# EAGLE design Wind Weather Station V2.1 (EAGLE 6.1)
COMPANY: ADAFRUIT INDUSTRIES; DRAWN: KTOWN; REV: B
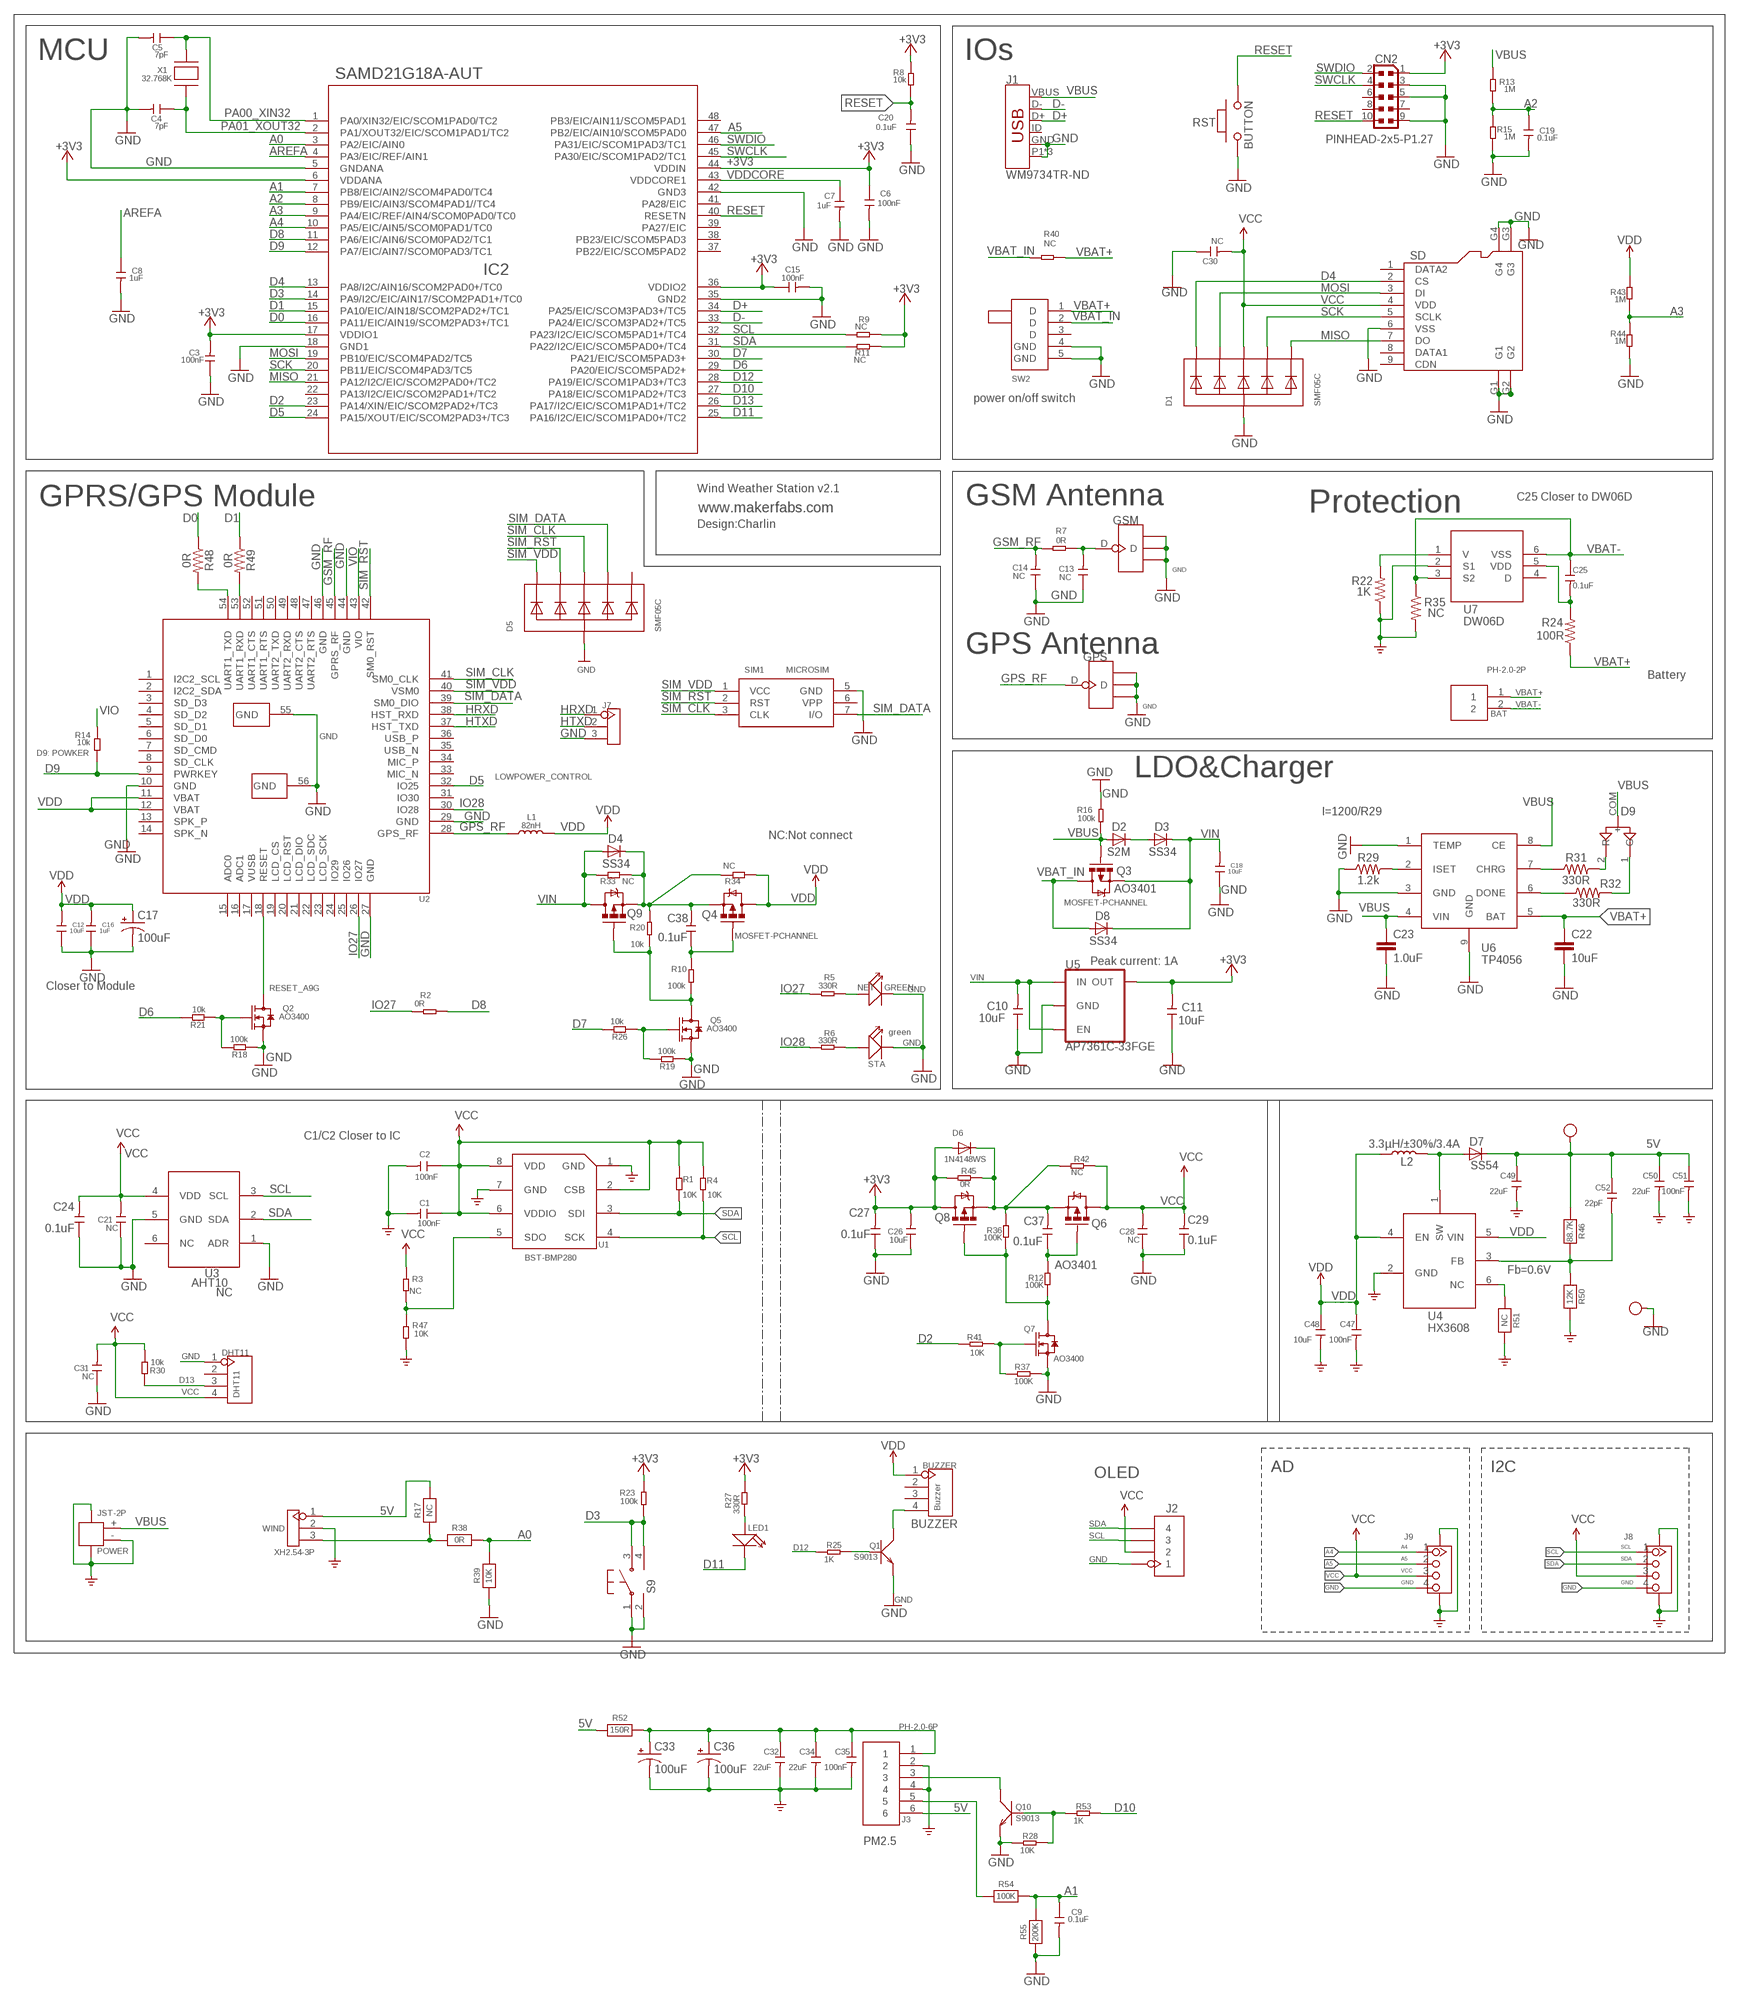
[diagram p0: schematic, sheet 1]

## Parts
5V  TEST-POINT'4545'  [TP-D45MIL]
BAT  PH-2.0-2P  [PH-2.0-2P]
BUZZER  Buzzer  HEADER-4P-60/35MILROUND  [4P-65/35ROUND]
C1  100nF  CAP-0603  [C0603]
C2  100nF  CAP-0603  [C0603]
C3  100nF  C-0603  [0603]
C4  7pF  C-0603  [0603]
C5  7pF  C-0603  [0603]
C6  100nF  C-0603  [0603]
C7  1uF  C-0603  [0603]
C8  1uF  C-0603  [0603]
C9  0.1uF  C-0603  [0603]
C10  10uF  C-0603  [0603]
C11  10uF  C-0603  [0603]
C12  10uF  C-0603  [0603]
C13  NC  C-0402  [0402]
C14  NC  C-0402  [0402]
C15  100nF  C-0603  [0603]
C16  1uF  C-0603  [0603]
C17  100uF  68UF-POLAR-EIA3528-10V-10%(TANT)  [EIA3528]
C18  10uF  C-0603  [0603]
C19  0.1uF  C-0603  [0603]
C20  0.1uF  C-0603  [0603]
C21  NC  C-0603  [0603]
C22  10uF  10UF-1206-6.3V-20%  [1206]
C23  1.0uF  1.0UF-0603-16V-10%  [0603]
C24  0.1uF  C-0603  [0603]
C25  0.1uF  C-0603  [0603]
C26  10uF  C-0603  [0603]
C27  0.1uF  C-0603  [0603]
C28  NC  C-0603  [0603]
C29  0.1uF  C-0603  [0603]
C30  NC  DISCRETE_C-0603  [DISCRETE_C0603]
C31  NC  C-0603  [0603]
C32  22uF  CAP-0603  [C0603]
C33  100uF  68UF-POLAR-EIA3528-10V-10%(TANT)  [EIA3528]
C34  22uF  CAP-0603  [C0603]
C35  100nF  CAP-0603  [C0603]
C36  100uF  68UF-POLAR-EIA3528-10V-10%(TANT)  [EIA3528]
C37  0.1uF  C-0603  [0603]
C38  0.1uF  C-0603  [0603]
C47  100nF  CAP-0603  [C0603]
C48  10uF  CAP-0603  [C0603]
C49  22uF  CAP-0603  [C0603]
C50  22uF  CAP-0603  [C0603]
C51  100nF  CAP-0603  [C0603]
C52  22pF  CAP-0603  [C0603]
CN2  PINHEAD-2x5-P1.27  0171_PH127-205DF055G00AROUND-PADS  [PINHEAD_2X05_127]
D1  SMF05C  TVSARRAY_5LANE  [SOT363]
D2  S2M  DIODE-DO-214AC  [DO-214AC]
D3  SS34  DIODE-DO-214AC  [DO-214AC]
D4  SS34  DIODE-DO-214AC  [DO-214AC]
D5  SMF05C  TVSARRAY_5LANE  [SOT363]
D6  1N4148WS  DIODESOD-323F  [SOD-323F]
D7  SS54  DIODE-DO-214AC  [DO-214AC]
D8  SS34  DIODE-DO-214AC  [DO-214AC]
D9  LED-ARG-3P'-3MM'  [LED-3P-2.54-3MM]
DHT11  DHT11  HEADER-4P-60/35MILROUND  [4P-65/35ROUND]
GND  TEST-POINT'4545'  [TP-D45MIL]
GPS  ANTENNA-U-FL  [4P-U-FL]
GSM  ANTENNA-U-FL  [4P-U-FL]
IC2  SAMD21G18A-AUT  ATSAMD21G18A-AUT  [TQFP48-7X7]
J1  WM9734TR-ND  USB_MICRO-B_FEMALE-SMT-VERT  [USB-B-MICRO-SMD_VERT]
J2  HEADER-1X4P  [SMD4-2.54P]
J3  PH-2.0-6P  [PH-2.0-6P]
J7  HEADER-3P-2.54  [3P-2.54]
J8  GROVE-CONNECTOR-SMD'90D'  [HW4-SMD-2.0-90D]
J9  GROVE-CONNECTOR-SMD'90D'  [HW4-SMD-2.0-90D]
L1  82nH  L'0603'  [L0603]
L2  3.3µH/±30%/3.4A  INDUCTOR-CR54-3.3UH  [CR54]
LED1  DISCRETE_LED0603  [DISCRETE_LED-0603]
NET  GREEN  DISCRETE_LED0603  [DISCRETE_LED-0603]
POWER  JST-2P  JST-2P-SMD'2.0'  [HW2-SMD-2.0-90D]
Q1  S9013  TRANSISTOR-NPN-SOT23  [SOT23]
Q2  AO3400  MOSFET-N'SOT23'  [SOT23@1]
Q3  MOSFET-PCHANNEL  [SOT23-3]
Q4  MOSFET-PCHANNEL  [SOT23-3]
Q5  AO3400  MOSFET-N'SOT23'  [SOT23@1]
Q6  MOSFET-PCHANNEL  [SOT23-3]
Q7  AO3400  DISCRETE_MOSFET-NSOT23  [DISCRETE_SOT23]
Q8  MOSFET-PCHANNEL  [SOT23-3]
Q9  MOSFET-PCHANNEL  [SOT23-3]
Q10  S9013  TRANSISTOR-NPN-SOT23  [SOT23]
R1  10K  RES-0603  [R0603]
R2  0R  R-0603  [R0603]
R3  NC  RES-0603  [R0603]
R4  10K  RES-0603  [R0603]
R5  330R  R-0603  [R0603]
R6  330R  R-0603  [R0603]
R7  0R  R-0603  [R0603]
R8  10k  R-0603  [R0603]
R9  NC  R-0603  [R0603]
R10  100k  R-0603  [R0603]
R11  NC  R-0603  [R0603]
R12  100K  R-0603  [R0603]
R13  1M  R-0603  [R0603]
R14  10k  R-0603  [R0603]
R15  1M  R-0603  [R0603]
R16  100k  R-0603  [R0603]
R17  NC  RESISTOR_0603_NOOUT  [0603-NO]
R18  100k  R-0603  [R0603]
R19  100k  R-0603  [R0603]
R20  10k  R-0603  [R0603]
R21  10k  R-0603  [R0603]
R22  1K  10KOHM-0603-1/10W-1%  [0603]
R23  100k  R-0603  [R0603]
R24  100R  10KOHM-0603-1/10W-1%  [0603]
R25  1K  R-0603  [R0603]
R26  10k  R-0603  [R0603]
R27  330R  R-0603  [R0603]
R28  10K  R-0603  [R0603]
R29  1.2k  2.49KOHM-0603-1/10W-1%  [0603]
R30  10k  R-0603  [R0603]
R31  330R  330OHM-0603-1/10W-1%  [0603]
R32  330R  330OHM-0603-1/10W-1%  [0603]
R33  NC  R-0603  [R0603]
R34  NC  R-0603  [R0603]
R35  NC  10KOHM-0603-1/10W-1%  [0603]
R36  100K  R-0603  [R0603]
R37  100K  R-0603  [R0603]
R38  0R  RESISTOR_0603_NOOUT  [0603-NO]
R39  10K  RESISTOR_0603_NOOUT  [0603-NO]
R40  NC  R-0603  [R0603]
R41  10K  R-0603  [R0603]
R42  NC  R-0603  [R0603]
R43  1M  R-0603  [R0603]
R44  1M  R-0603  [R0603]
R45  0R  R-0603  [R0603]
R46  88.7K  RESISTOR_0603_NOOUT  [0603-NO]
R47  10K  RES-0603  [R0603]
R48  0R  4.7KOHM-0603-1/10W-1%  [0603]
R49  0R  4.7KOHM-0603-1/10W-1%  [0603]
R50  12K  RESISTOR_0603_NOOUT  [0603-NO]
R51  NC  RESISTOR_0603_NOOUT  [0603-NO]
R52  150R  RESISTOR_0603_NOOUT  [0603-NO]
R53  1K  R-0603  [R0603]
R54  100K  RESISTOR_0603_NOOUT  [0603-NO]
R55  200K  RESISTOR_0603_NOOUT  [0603-NO]
RST  BUTTON  PB157  [157SW]
S9  SWITCHES  [SMD4-6*6]
SD  HOLDER-MICROSD-9P  [9P-SMD-W/-RING]
SIM1  MICROSIM  [MICROSIM]
STA  green  LED'0603'  [LED-0603]
SW2  SWITCH  [DIP5-8.6*4.5MM]
U1  BST-BMP280  SENSOR-BMP280  [LGA8-0.65-2X2.5X0.95MM]
U2  A9G  [A9G]
U3  AHT10  [SMD6-127P-400L500W]
U4  HX3608  [SOT-23-6]
U5  AP7361C-33FGE  [8-UDFN]
U6  TP4056  [SOP8-1.27P]
U7  DW06D  [SOT-23-6]
WIND  XH2.54-3P  [XH2.54-3P]
X1  32.768K  XTAL-3.2X1.5  [XTAL3215]

## Nets
5V: 5V.T C49.1 C50.1 C51.1 C52.1 D7.C J3.6 R17.2 R46.1 R52.1 WIND.1
+3V3: C3.2 C6.1 C11.2 C15.1 C26.2 C27.2 CN2.1 D6.A IC2.6(VDDANA) IC2.17(VDDIO1) IC2.36(VDDIO2) IC2.44(VDDIN) Q8.3(D) R8.2 R9.2 R11.2 R23.2 R27.2 R45.2 U5.1(OUT)
A0: IC2.3(PA2/EIC/AIN0) R38.2 R39.2
A1: C9.1 IC2.7(PB8/EIC/AIN2/SCOM4PAD0/TC4) R54.2 R55.2
A2: C19.1 IC2.8(PB9/EIC/AIN3/SCOM4PAD1//TC4) R13.1 R15.2
A3: IC2.9(PA4/EIC/REF/AIN4/SCOM0PAD0/TC0) R43.1 R44.2
A4: IC2.10(PA5/EIC/AIN5/SCOM0PAD1/TC0) J9.1
A5: IC2.47(PB2/EIC/AIN10/SCOM5PAD0) J9.2
AREFA: C8.1 IC2.4(PA3/EIC/REF/AIN1)
D0: IC2.16(PA11/EIC/AIN19/SCOM2PAD3+/TC1) R48.1
D1: IC2.15(PA10/EIC/AIN18/SCOM2PAD2+/TC1) R49.1
D2: IC2.23(PA14/XIN/EIC/SCOM2PAD2+/TC3) R41.2
D3: IC2.14(PA9/I2C/EIC/AIN17/SCOM2PAD1+/TC0) R23.1 S9.3 S9.4
D4: D1.1(C1) IC2.13(PA8/I2C/AIN16/SCOM2PAD0+/TC0) SD.2(CS)
D5: IC2.24(PA15/XOUT/EIC/SCOM2PAD3+/TC3) U2.32(IO25)
D6: IC2.29(PA20/EIC/SCOM5PAD2+) R21.2
D7: IC2.30(PA21/EIC/SCOM5PAD3+) R26.2
D8: IC2.11(PA6/EIC/AIN6/SCOM0PAD2/TC1) R2.2
D9: IC2.12(PA7/EIC/AIN7/SCOM0PAD3/TC1) R14.1 U2.9(PWRKEY)
D10: IC2.27(PA18/EIC/SCOM1PAD2+/TC3) R53.2
D11: IC2.25(PA16/I2C/EIC/SCOM1PAD0+/TC2) LED1.-
D12: IC2.28(PA19/EIC/SCOM1PAD3+/TC3) R25.1
D13: DHT11.3 IC2.26(PA17/I2C/EIC/SCOM1PAD1+/TC2) R30.1
D+: IC2.34(PA25/EIC/SCOM3PAD3+/TC5) J1.D+
D-: IC2.33(PA24/EIC/SCOM3PAD2+/TC5) J1.D-
DONE: R32.1 U6.6(DONE)
GND: C1.2 C2.2 C3.1 C4.2 C5.2 C6.2 C7.2 C8.2 C9.2 C10.1 C11.1 C12.1 C13.1 C14.1 C15.2 C16.1 C17.C(-) C18.1 C19.2 C20.1 C21.1 C22.2 C23.2 C24.1 C26.1 C27.1 C28.1 C29.1 C30.1 C31.1 C32.2 C33.C(-) C34.2 C35.2 C36.C(-) C47.2 C48.2 C49.2 C50.2 C51.2 CN2.3 CN2.5 CN2.9 D1.2(A) D5.2(A) DHT11.1 GND.T GPS.GND1 GPS.GND2 GPS.GND3 GSM.GND1 GSM.GND2 GSM.GND3 IC2.5(GNDANA) IC2.18(GND1) IC2.35(GND2) IC2.42(GND3) J1.GND J1.P1(SHIELD) J1.P2(SHIELD) J1.P3(SHIELD) J2.1 J3.2 J3.4 J7.3 J8.4 J8.SS1 J8.SS2 J9.4 J9.SS1 J9.SS2 NET.- POWER.3 POWER.4 POWER.- Q1.2(E) Q2.2(S) Q5.2(S) Q7.2(S) Q10.2(E) R15.1 R16.2 R18.1 R19.1 R22.1 R28.1 R29.1 R35.2 R37.1 R39.1 R44.1 R47.1 R50.2 R51.2 R55.1 RST.2 S9.1 S9.2 SD.6(VSS) SD.G1 SD.G2 SD.G3 SD.G4 SIM1.5(GND) STA.- SW2.4(GND) SW2.5(GND) U1.1(GND) U1.7(GND) U2.10(GND) U2.27(GND) U2.29(GND) U2.44(GND) U2.46(GND) U2.55(GND) U2.56(GND) U3.1(ADR) U3.5(GND) U4.2(GND) U5.4(GND) U5.EP(GND) U6.1(TEMP) U6.3(GND) U6.9(GND) U7.2(S1) WIND.2
GPS_RF: GPS.D L1.1 U2.28(GPS_RF)
GSM_RF: C14.2 R7.1 U2.45(GPRS_RF)
HRXD: J7.1 U2.38(HST_RXD)
HTXD: J7.2 U2.37(HST_TXD)
IO27: R2.1 R5.1 U2.26(IO27)
IO28: R6.1 U2.30(IO28)
ISET: R29.2 U6.2(ISET)
MISO: D1.6(C5) IC2.21(PA12/I2C/EIC/SCOM2PAD0+/TC2) SD.7(DO)
MOSI: D1.3(C2) IC2.19(PB10/EIC/SCOM4PAD2/TC5) SD.3(DI)
N$1: R6.2 STA.+
N$2: D2.C D3.A
N$3: C38.1 Q4.1(G) R10.2
N$4: Q5.1(G) R19.2 R26.1
N$5: LED1.+ R27.1
N$6: C37.2 D6.C Q6.2(S) Q8.2(S) R36.2 R42.2 R45.1
N$7: NET.+ R5.2
N$8: Q2.3(D) U2.18(RESET)
N$9: BUZZER.4 Q1.3(C)
N$10: R17.1 R38.1 WIND.3
N$11: C38.2 D4.C Q4.2(S) Q9.2(S) R20.2 R33.1 R34.2
N$12: Q2.1(G) R18.2 R21.1
N$13: D9.1(G) R32.2
N$14: R31.1 U6.7(CHRG)
N$15: Q7.3(D) Q8.1(G) R12.1 R36.1
N$16: C25.2 R24.2 U7.5(VDD)
N$17: R22.2 U7.1(V)
N$18: D9.2(R) R31.2
N$19: Q7.1(G) R37.2 R41.1
N$20: R3.1 R47.2 U1.5(SDO)
N$21: R49.2 U2.53(UART1_RXD)
N$22: R48.2 U2.54(UART1_TXD)
N$23: D7.A L2.P$2 U4.1(SW)
N$24: Q1.1(B) R25.2
N$25: C52.2 R46.2 R50.1 U4.3(FB)
N$26: R51.1 U4.6(NC)
N$27: C32.1 C33.A(+) C34.1 C35.1 C36.A(+) J3.1 R52.2
N$28: Q10.1(B) R28.2 R53.1
N$29: J3.3 Q10.3(C)
N$30: J3.5 R54.1
N$31: Q5.3(D) Q9.1(G) R10.1 R20.1
N$32: C37.1 Q6.1(G) R12.2
N$94: C13.2 GSM.D R7.2
PA00_XIN32: C5.1 IC2.1(PA0/XIN32/EIC/SCOM1PAD0/TC2) X1.P$2
PA01_XOUT32: C4.1 IC2.2(PA1/XOUT32/EIC/SCOM1PAD1/TC2) X1.P$1
RESET: C20.2 CN2.10 IC2.40(RESETN) R8.1 RST.1
SCK: D1.5(C4) IC2.20(PB11/EIC/SCOM4PAD3/TC5) SD.5(SCLK)
SCL: IC2.32(PA23/I2C/EIC/SCOM5PAD1+/TC4) J2.3 J8.1 R4.1 R9.1 U1.4(SCK) U3.3(SCL)
SDA: IC2.31(PA22/I2C/EIC/SCOM5PAD0+/TC4) J2.4 J8.2 R1.1 R11.1 U1.3(SDI) U3.2(SDA)
SIM_CLK: D5.4(C3) SIM1.3(CLK) U2.41(SM0_CLK)
SIM_DATA: D5.5(C4) SIM1.7(I/O) U2.39(SM0_DIO)
SIM_RST: D5.3(C2) SIM1.2(RST) U2.42(SM0_RST)
SIM_VDD: D5.1(C1) SIM1.1(VCC) U2.40(VSM0)
SWCLK: CN2.4 IC2.45(PA30/EIC/SCOM1PAD2/TC1)
SWDIO: CN2.2 IC2.46(PA31/EIC/SCOM1PAD3/TC1)
VBAT+: BAT.1 C22.1 R24.1 R40.2 SW2.1(D) U6.5(BAT)
VBAT-: BAT.2 C25.1 R35.1 U7.3(S2) U7.6(VSS)
VBAT_IN: D8.A Q3.3(D) R40.1 SW2.2(D)
VBUS: C23.1 D2.A D9.COM(+) J1.VBUS POWER.+ Q3.1(G) R13.2 R16.1 U6.4(VIN) U6.8(CE)
VCC: C1.1 C2.1 C21.2 C24.2 C28.2 C29.2 C30.2 C31.2 D1.4(C3) DHT11.4 J2.2 J8.3 J9.3 Q6.3(D) R1.2 R3.2 R4.2 R30.2 R42.1 SD.4(VDD) U1.2(CSB) U1.6(VDDIO) U1.8(VDD) U3.4(VDD)
VDD: BUZZER.1 C12.2 C16.2 C17.A(+) C47.1 C48.1 L1.2 L2.P$1 Q4.3(D) R34.1 R43.2 U2.11(VBAT) U2.12(VBAT) U4.4(EN) U4.5(VIN)
VDDCORE: C7.1 IC2.43(VDDCORE1)
VIN: C10.2 C18.2 D3.C D4.A D8.C Q3.2(S) Q9.3(D) R33.2 U5.5(EN) U5.8(IN)
VIO: R14.2 U2.43(VIO)
Unconnected: BUZZER.2 BUZZER.3 CN2.6 CN2.7 CN2.8 D5.6(C5) DHT11.2 IC2.22(PA13/I2C/EIC/SCOM2PAD1+/TC2) IC2.37(PB22/EIC/SCOM5PAD2) IC2.38(PB23/EIC/SCOM5PAD3) IC2.39(PA27/EIC) IC2.41(PA28/EIC) IC2.48(PB3/EIC/AIN11/SCOM5PAD1) J1.ID SD.1(DATA2) SD.8(DATA1) SD.9(CDN) SIM1.6(VPP) SW2.3(D) U2.1(I2C2_SCL) U2.2(I2C2_SDA) U2.3(SD_D3) U2.4(SD_D2) U2.5(SD_D1) U2.6(SD_D0) U2.7(SD_CMD) U2.8(SD_CLK) U2.13(SPK_P) U2.14(SPK_N) U2.15(ADC0) U2.16(ADC1) U2.17(VUSB) U2.19(LCD_CS) U2.20(LCD_RST) U2.21(LCD_DIO) U2.22(LCD_SDC) U2.23(LCD_SCK) U2.24(IO29) U2.25(IO26) U2.31(IO30) U2.33(MIC_N) U2.34(MIC_P) U2.35(USB_N) U2.36(USB_P) U2.47(UART2_RTS) U2.48(UART2_CTS) U2.49(UART2_RXD) U2.50(UART2_TXD) U2.51(UART1_RTS) U2.52(UART1_CTS) U3.6(NC) U7.4(D)

## Notes on the sheet
- MCU | IOs
- power on/off switch
- Wind Weather Station v2.1
- C25 Closer to DW06D
- GPRS/GPS Module | GSM Antenna
- www.makerfabs.com | Protection
- Design:Charlin
- GPS Antenna
- Battery
- D9: POWKER
- LDO&Charger
- LOWPOWER_CONTROL
- I=1200/R29
- NC:Not connect
- AO3401
- Peak current: 1A
- Closer to Module | RESET_A9G
- C1/C2 Closer to IC
- AO3401
- Fb=0.6V
- NC
- AD | I2C
- OLED
- BUZZER
- PM2.5

## Library data of the parts
5V GND = Discrete-new:TEST-POINT; PARTNO: DNP
BAT = Connector:PH-2.0-2P
BUZZER DHT11 = Connector:HEADER-4P
C1 C2 C32 C34 C35 C47-C52 = Discrete-new:CAP: Ceramic Capacitors
C3-C16 C18-C21 C24-C29 C31 C37 C38 = Discrete:C*: Ceramic Capacitors
C17 C33 C36 = SparkFun-Capacitors:68UF-POLAR: 68µF polarized capacitors A capacitor is a passive two-terminal electrical component used to store electrical energy temporarily in an electric field.; PROD_ID: CAP-10790; VALUE: 68uF
C22 = SparkFun-Capacitors:10UF: 10.0µF ceramic capacitors A capacitor is a passive two-terminal electrical component used to store electrical energy temporarily in an electric field.; PROD_ID: CAP-10057
C23 = SparkFun-Capacitors:1.0UF: 1µF ceramic capacitors A capacitor is a passive two-terminal electrical component used to store electrical energy temporarily in an electric field.; PROD_ID: CAP-00868
C30 = A9G:DISCRETE_C*: Ceramic Capacitors
CN2 = Connettori:0171_PH127-205DF055G00A: 2x5 PASSO 1,27
D1 D5 = microbuilder:TVSARRAY_5LANE: Voltage Transient Suppressor Array SOT363 SMF05C - 100W 5V: Digikey - SMF05CT1GOSCT-ND
D2-D4 D7 D8 = diode:DIODE-: DIODE
D6 = adafruit:DIODE: Diode SMADIODE - SMA Surface Mount Package 20V 1A Schottky Diode Digikey: 641-1014-6-ND DO-1N4148 - Through Hole Small Current Diode SOD-123 20V 1 A (.5mV Vf) Schottky Diode - Digikey: MBRX120TPMSCT-ND SOD-323 10V 570mA (.38mV Vf, 3ns) Schottky Diode - Digikey: ZLLS410CT-ND SOD-523 30V 30mA Schottky Diode (RB751S-40TE61) - Digikey: RB751S-40TE61CT-ND SOT23-R/W - SOT23 Package (R = Solder Paste/Reflow Ovens, W = Hand-Soldering) BAT54Film 40V 300mA - Digikey: 497-7162-1-ND
D9 = Discrete:LED-ARG-3P
GPS GSM = Connector:ANTENNA-U-FL
IC2 = IC:ATSAMD21G18A-AUT: Atmel D21 32bit ARM Cortex-M0 microcontroller - 48 PIN TQFP 256KB flash memory + 32KB SRAM
J1 = SparkFun-Connectors:USB_MICRO-B: USB Type Micro-B Connector Male/female and PTH/SMT variants SparkFun Products: SparkFun microB USB Breakout <https://www.sparkfun.com/products/12035> SparkFun USB microB Plug Breakout <https://www.sparkfun.com/products/10031> SparkFun ESP8266 Thing <https://www.sparkfun.com/products/13231>; PROD_ID: CONN-13534
J2 = self:HEADER-1X4P
J3 = Connector:PH-2.0-6P
J7 = Connector:HEADER-3P
J8 J9 = Connector-new:GROVE-CONNECTOR-SMD: 4P-SMD-2.0:320110030;4P-SMD-2.0-90D:320110032
L1 = Discrete:L*
L2 = SparkFun-Coils:INDUCTOR: Inductors Resist changes in electrical current. Basically a coil of wire. SparkFun Products: SparkFun Load Cell Amplifier - HX711 <https://www.sparkfun.com/products/13879> IOIO-OTG - V2.2 <https://www.sparkfun.com/products/13613>; PROD_ID: NDUC-11157
LED1 NET = A9G:DISCRETE_LED*
POWER = Connector-new:JST-2P-SMD: 2P-SMD-1.0-90D:320110054;2P-SMD-2.0-90D:320110026
Q1 Q10 = Discrete:TRANSISTOR-NPN*: NPN audion
Q2 Q5 = Discrete:MOSFET-N: IRLL014: http://www.vishay.com/docs/91319/sihll014.pdf
Q3 Q4 Q6 Q8 Q9 = User-Submitted:MOSFET-PCHANNEL: Generic PMOSFET IRLML2244 - TRANS-11153 (SOT-23 -20V -4.3A) (1.Gate 2.Source 3.Drain) FQP27P06 - COM-10349 <http://www.sparkfun.com/products/10349> (TO-220 -60V -27A) (1.Gate 2.Source 3.Drain); PROD_ID: TRANS-08285
Q7 = A9G:DISCRETE_MOSFET-N: IRLL014: http://www.vishay.com/docs/91319/sihll014.pdf
R1 R3 R4 R47 = Discrete-new:RES
R2 R5-R16 R18-R21 R23 R25-R28 R30 R33 R34 R36 R37 R40-R45 R53 = Discrete:R*
R17 R38 R39 R46 R50-R52 R54 R55 = microbuilder:RESISTOR: Resistors For new designs, use the packages preceded by an '_' character since they are more reliable: The following footprints should be used on most boards: _0402 - Standard footprint for regular board layouts _0603 - Standard footprint for regular board layouts _0805 - Standard footprint for regular board layouts _1206 - Standard footprint for regular board layouts For extremely tight-pitch boards where space is at a premium, the following 'micro-pitch' footprints can be used (smaller pads, no silkscreen outline, etc.): _0402MP - Micro-pitch footprint for very dense/compact boards _0603MP - Micro-pitch footprint for very dense/compact boards _0805MP - Micro-pitch footprint for very dense/compact boards _1206MP - Micro-pitch footprint for very dense/compact boards
R22 R24 R35 = SparkFun-Resistors:10KOHM: 10kΩ resistor A resistor is a passive two-terminal electrical component that implements electrical resistance as a circuit element. Resistors act to reduce current flow, and, at the same time, act to lower voltage levels within circuits.; PROD_ID: RES-00824; VALUE: 10k
R29 = SparkFun-Resistors:2.49KOHM: 2.49kΩ resistor A resistor is a passive two-terminal electrical component that implements electrical resistance as a circuit element. Resistors act to reduce current flow, and, at the same time, act to lower voltage levels within circuits. - Wikipedia; PROD_ID: RES-09568; VALUE: 2.49k
R31 R32 = SparkFun-Resistors:330OHM: 330Ω resistor A resistor is a passive two-terminal electrical component that implements electrical resistance as a circuit element. Resistors act to reduce current flow, and, at the same time, act to lower voltage levels within circuits. - Wikipedia; PROD_ID: RES-00818; VALUE: 330
R48 R49 = SparkFun-Resistors:4.7KOHM: 4.7kΩ resistor A resistor is a passive two-terminal electrical component that implements electrical resistance as a circuit element. Resistors act to reduce current flow, and, at the same time, act to lower voltage levels within circuits. - Wikipedia; PROD_ID: RES-07857; VALUE: 4.7k
RST = MySMD:PB157
S9 = self:SWITCHES
SD = Connector:HOLDER-MICROSD-9P
SIM1 = Connector:MICROSIM
STA = Discrete:LED*
SW2 = self:SWITCH
U1 = template:SENSOR-BMP280: Digital Pressure Sensor; MPN: BMP280
U2 = A9G:A9G
U3 = self:AHT10
U4 = self:HX3608
U5 = ublox:AP7361C-33FGE: AP7361C 3.3V LDO Regulator; PROD_ID: VREG-14094
U6 = self:TP4056
U7 = self:DW06D
WIND = Connector:XH2.54-3P
X1 = adafruit2:XTAL: Low cost SMT crystals, no capacitors included http://www.ladyada.net/library/eagle

## Net classes
0 default: width 0.203 mm, drill 0.305 mm, clearance 0.152 mm

## Board
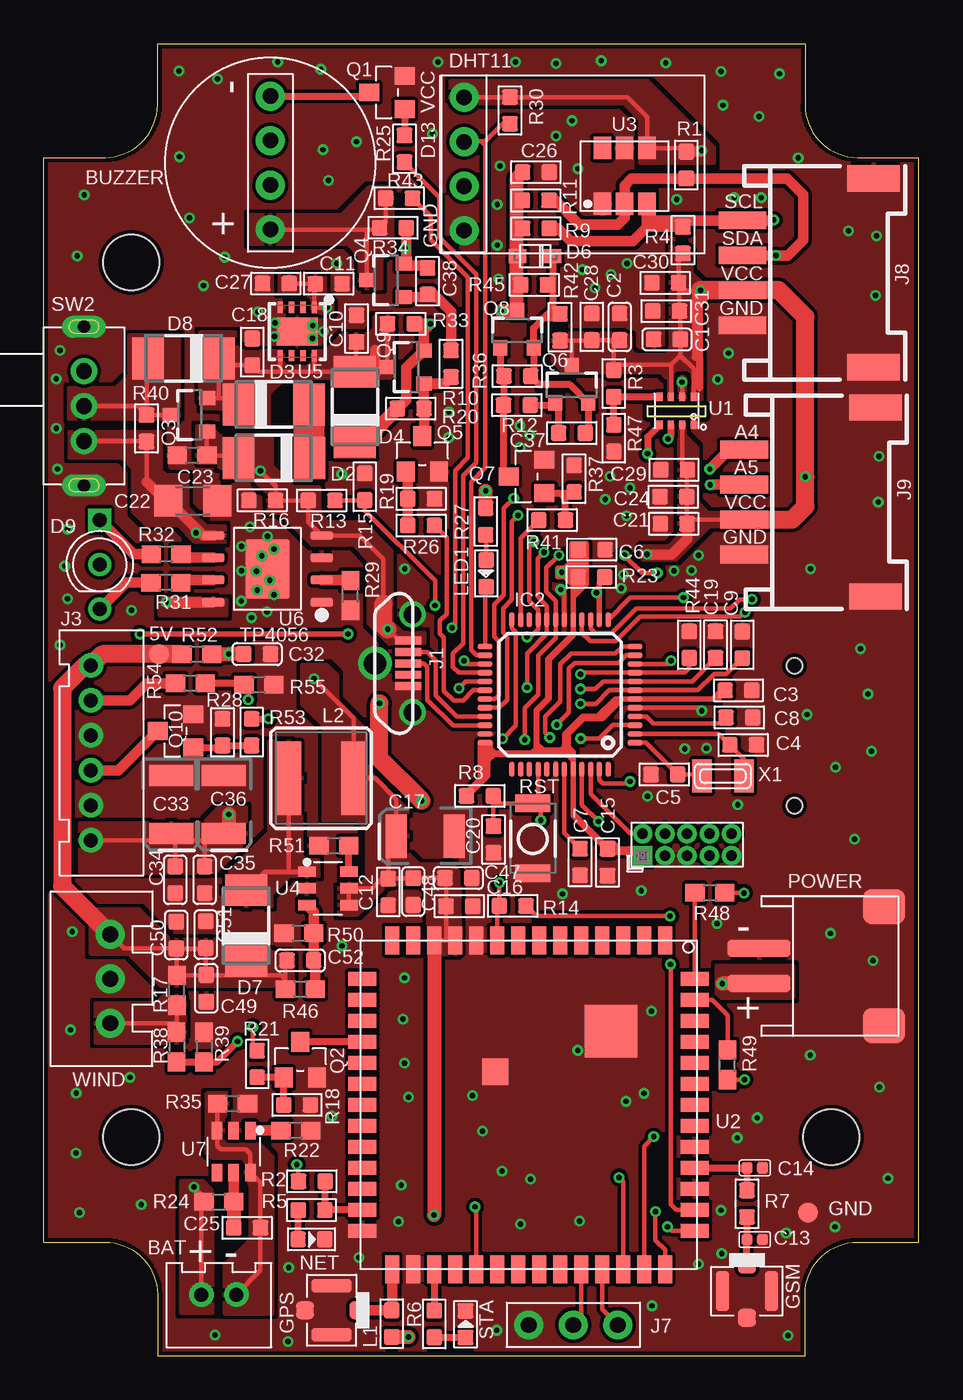
[diagram p1: board, top side]
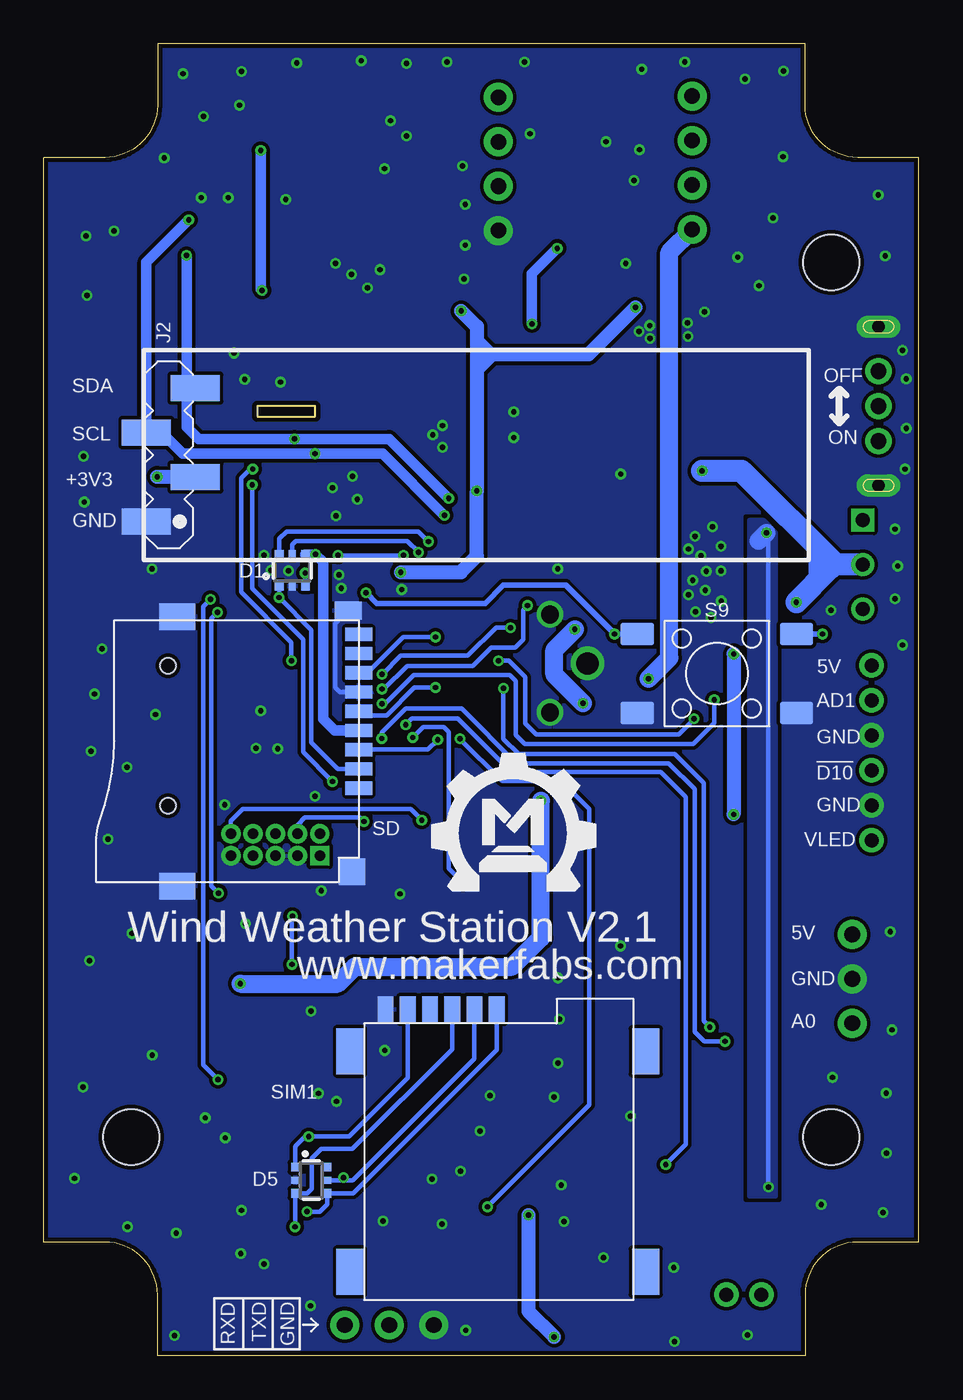
[diagram p2: board, bottom side, seen from below]

Size 50 x 75 mm. Coordinates in mm from the lower left corner, seen from the top.
Outline: 50,6.5 50,68.5 46.5,68.5 arc-90 43.5,71.5 43.5,75 6.5,75 6.5,71.5 arc-90 3.5,68.5 0,68.5 0,6.5 3.5,6.5 arc-90 6.5,3.5 6.5,0 43.5,0 43.5,3.5 arc-90 46.5,6.5 50,6.5
Outline: 34.5,54.3 37.8,54.3 37.8,53.7 34.5,53.7 34.5,54.3
Copper layers (1*16): Top 0.035mm / dielectric 1.5mm / Bottom 0.035mm
Design rules: minimum track width 6mil, minimum drill 12mil, track to track 8mil, track to pad 8mil, pad to pad 8mil, via to via 8mil, smd to smd 0mil, copper to edge 10mil, drill to drill 10mil, minimum pad ring 10mil, minimum via ring 6mil, stop-mask expansion 2mil, vias tented up to drill 100mil, thermal gap 0mil
Holes 3.2 mm at 5,12.5 45,12.5 5,62.5

### Footprints (pad centres in the part's own frame; a part is rotated, then mirrored left to right if it is on the bottom)
TP-D45MIL = smd 1.143 x 1.143: T 0,0
PH-2.0-2P = drill 0.8 pad 1.4: 1 -1,0; 2 1,0
4P-65/35ROUND = drill 0.889 pad 1.651: 1 0,3.81; 2 0,1.27; 3 0,-1.27; 4 0,-3.81
C0603 = smd 0.889 x 0.889: 1 0,0.762; 2 0,-0.762
0603 = smd 0.889 x 0.889: 1 -0.762,0; 2 0.762,0
0402 = smd 0.635 x 0.635: 1 -0.445,0; 2 0.445,0
EIA3528 = smd 1.2 x 2.5: A 1.65,0; C -1.65,0
1206 = smd 1.6 x 1.8: 1 -1.4,0; 2 1.4,0
0603' = smd 1.1 x 1: 1 -0.85,0; 2 0.85,0
DISCRETE_C0603 = smd 0.889 x 0.889: 1 -0.762,0; 2 0.762,0
PINHEAD_2X05_127 = drill 0.6 pad 1.016 square: 1 -0.635,2.54 | drill 0.6 pad 1.016: 2 0.635,2.54; 3 -0.635,1.27; 4 0.635,1.27; 5 -0.635,0; 6 0.635,0; 7 -0.635,-1.27; 8 0.635,-1.27; 9 -0.635,-2.54; 10 0.635,-2.54
SOT363 = smd 0.5 x 0.5: 1 -0.75,-0.9; 3 0.75,-0.9; 4 0.75,0.9; 6 -0.75,0.9 | smd 0.4 x 0.5: 2 0,-0.9; 5 0,0.9
DO-214AC = smd 1.8 x 2.4: A 2.025,0; C -2.025,0
SOD-323F = smd 1 x 0.8: A -1,0; C 1,0
LED-3P-2.54-3MM = drill 0.8 pad 1.3 square: 1 -2.54,0 | drill 0.8 pad 1.3: 2 2.54,0; COM 0,0
4P-U-FL = smd 1.016 x 1.016: D -1.524,0; GND3 1.524,0 | smd 2.286 x 0.762: GND1 0,1.397; GND2 0,-1.397
TQFP48-7X7 = smd 0.85 x 0.32: 1 -4.275,2.75; 2 -4.275,2.25; 3 -4.275,1.75; 4 -4.275,1.25; 5 -4.275,0.75; 6 -4.275,0.25; 7 -4.275,-0.25; 8 -4.275,-0.75; 9 -4.275,-1.25; 10 -4.275,-1.75; 11 -4.275,-2.25; 12 -4.275,-2.75; 25 4.275,-2.75; 26 4.275,-2.25; 27 4.275,-1.75; 28 4.275,-1.25; 29 4.275,-0.75; 30 4.275,-0.25; 31 4.275,0.25; 32 4.275,0.75; 33 4.275,1.25; 34 4.275,1.75; 35 4.275,2.25; 36 4.275,2.75 | smd 0.32 x 0.85: 13 -2.75,-4.275; 14 -2.25,-4.275; 15 -1.75,-4.275; 16 -1.25,-4.275; 17 -0.75,-4.275; 18 -0.25,-4.275; 19 0.25,-4.275; 20 0.75,-4.275; 21 1.25,-4.275; 22 1.75,-4.275; 23 2.25,-4.275; 24 2.75,-4.275; 37 2.75,4.275; 38 2.25,4.275; 39 1.75,4.275; 40 1.25,4.275; 41 0.75,4.275; 42 0.25,4.275; 43 -0.25,4.275; 44 -0.75,4.275; 45 -1.25,4.275; 46 -1.75,4.275; 47 -2.25,4.275; 48 -2.75,4.275
USB-B-MICRO-SMD_VERT = smd 0.45 x 1.5: D+ 0,0.825; D- -0.65,0.825; GND 1.3,0.825; ID 0.65,0.825; VBUS -1.3,0.825 | drill 1.016: P1 -2.8,1.075; P2 2.8,1.075 | drill 1.27: P3 0,-1.075
SMD4-2.54P = smd 1.5 x 2.8: 1 -3.81,1.4; 2 -1.27,-1.4; 3 1.27,1.4; 4 3.81,-1.4
PH-2.0-6P = drill 0.8 pad 1.4: 1 -5,0; 2 -3,0; 3 -1,0; 4 1,0; 5 3,0; 6 5,0
3P-2.54 = drill 0.9 pad 1.651: 1 0,2.54; 2 0,0; 3 0,-2.54
HW4-SMD-2.0-90D = smd 1.01 x 2.74: 1 -3,-0.1; 2 -1,-0.1; 3 1,-0.1; 4 3,-0.1 | smd 1.5 x 3: SS1 -5.4,7.4; SS2 5.4,7.4
L0603 = smd 0.889 x 0.889: 1 -0.762,0; 2 0.762,0
CR54 = smd 4.2 x 1.4: P$1 0,1.85; P$2 0,-1.85
DISCRETE_LED-0603 = smd 0.889 x 0.889: + -0.762,0; - 0.762,0
HW2-SMD-2.0-90D = smd 2 x 2.4: 3 3.4,-2.181; 4 -3.4,-2.181 | smd 1 x 3.6: + -1,4.953; - 1,4.953
SOT23 = smd 1.016 x 1.143: 1 -0.95,-1.016; 2 0.95,-1.016; 3 0,1.016
SOT23@1 = smd 1.016 x 1.143: 1 -0.95,-1.016; 2 0.95,-1.016; 3 0,1.016
SOT23-3 = smd 0.8 x 0.9: 1 -0.95,-1; 2 0.95,-1; 3 0,1.1
DISCRETE_SOT23 = smd 1.016 x 1.143: 1 -0.95,-1.016; 2 0.95,-1.016; 3 0,1.016
R0603 = smd 0.889 x 0.889: 1 0,0.762; 2 0,-0.762
R0603' = smd 0.889 x 0.889: 1 -0.762,0; 2 0.762,0
0603-NO = smd 1.1 x 1: 1 -0.85,0; 2 0.85,0
157SW = smd 1.016 x 1.981: 1 0,0; 2 4,0
SMD4-6*6 = smd 1.9 x 1.3: 1 -4.55,2.25; 2 4.55,2.25; 3 -4.55,-2.25; 4 4.55,-2.25
9P-SMD-W/-RING = smd 1.524 x 0.762: 1 0,4.4; 2 0,3.3; 3 0,2.2; 4 0,1.1; 5 0,0; 6 0,-1.1; 7 0,-2.2; 8 0,-3.3; 9 0,-4.4 | smd 1.524 x 1.016: G1 0.6,-5.746 | smd 2.032 x 1.524: G2 10.373,-5.4; G3 10.373,10 | smd 1.524 x 1.524: G4 0.392,9.181 | hole 0.889: 10.9,-2.6; 10.9,5.4
MICROSIM = smd 1.5 x 0.9: 1 -0.8,2.5; 2 -0.8,5.04; 3 -0.8,7.58; 5 -0.8,1.23; 6 -0.8,3.77; 7 -0.8,6.31 | smd 2.61 x 1.56: P$1 1.6,-0.8; P$2 14.2,-0.8; P$3 14.2,16.1; P$4 1.6,16.1
LED-0603 = smd 0.889 x 0.889: + -0.762,0; - 0.762,0
DIP5-8.6*4.5MM = drill 0.9 pad 1.5: 1 -2,0; 2 0,0; 3 2,0 | drill 0.7 pad 1.27 long: 4 -4.54,0; 5 4.54,0
LGA8-0.65-2X2.5X0.95MM = smd 0.5 x 0.35: 1 0.8,0.975; 2 0.8,0.325; 3 0.8,-0.325; 4 0.8,-0.975; 5 -0.8,-0.975; 6 -0.8,-0.325; 7 -0.8,0.325; 8 -0.8,0.975
A9G = smd 1.6 x 0.8: 1 -9.4,7.8; 2 -9.4,6.6; 3 -9.4,5.4; 4 -9.4,4.2; 5 -9.4,3; 6 -9.4,1.8; 7 -9.4,0.6; 8 -9.4,-0.6; 9 -9.4,-1.8; 10 -9.4,-3; 11 -9.4,-4.2; 12 -9.4,-5.4; 13 -9.4,-6.6; 14 -9.4,-7.8; 28 9.4,-7.8; 29 9.4,-6.6; 30 9.4,-5.4; 31 9.4,-4.2; 32 9.4,-3; 33 9.4,-1.8; 34 9.4,-0.6; 35 9.4,0.6; 36 9.4,1.8; 37 9.4,3; 38 9.4,4.2; 39 9.4,5.4; 40 9.4,6.6; 41 9.4,7.8 | smd 0.8 x 1.6: 15 -7.2,-9.5; 16 -6,-9.5; 17 -4.8,-9.5; 18 -3.6,-9.5; 19 -2.4,-9.5; 20 -1.2,-9.5; 21 0,-9.5; 22 1.2,-9.5; 23 2.4,-9.5; 24 3.6,-9.5; 25 4.8,-9.5; 26 6,-9.5; 27 7.2,-9.5; 42 7.2,9.5; 43 6,9.5; 44 4.8,9.5; 45 3.6,9.5; 46 2.4,9.5; 47 1.2,9.5; 48 0,9.5; 49 -1.2,9.5; 50 -2.4,9.5; 51 -3.6,9.5; 52 -4.8,9.5; 53 -6,9.5; 54 -7.2,9.5 | smd 3 x 3: 55 -4.2,4.7 | smd 1.5 x 1.5: 56 -1.9,-1.9
SMD6-127P-400L500W = smd 1.27 x 1: 1 -1.6,1.27; 2 -1.6,0; 3 -1.6,-1.27; 4 1.6,-1.27; 5 1.6,0; 6 1.6,1.27
SOT-23-6 = smd 1 x 0.6: 1 -1.2,0.95; 2 -1.2,0; 3 -1.2,-0.95; 4 1.2,-0.95; 5 1.2,0; 6 1.2,0.95
8-UDFN = smd 0.3 x 0.65: 1 -0.975,-1.375; 2 -0.325,-1.375; 3 0.325,-1.375; 4 0.975,-1.375; 5 0.975,1.375; 6 0.325,1.375; 7 -0.325,1.375; 8 -0.975,1.375 | smd 2.35 x 1.6: EP 0,0
SOP8-1.27P = smd 1.27 x 0.51: 1 -3.1,1.905; 2 -3.1,0.635; 3 -3.1,-0.635; 4 -3.1,-1.905; 5 3.1,-1.905; 6 3.1,-0.635; 7 3.1,0.635; 8 3.1,1.905 | smd 2.5 x 3.4: 9 0,0
XH2.54-3P = drill 0.9 pad 1.651: 1 -2.54,0; 2 0,0; 3 2.54,0
XTAL3215 = smd 1.1 x 1.9: P$1 1.2,0; P$2 -1.2,0

### Placement (x,y rotation side)
5V  6.59,40.11 0 top
BAT  10,3.5 0 top
BUZZER  12.95,68.19 180 top
C1  35.61,58.1 270 top
C2  32.91,58.82 180 top
C3  39.7,38.04 180 top
C4  39.97,34.92 0 top
C5  35.46,33.23 180 top
C6  31.31,46.08 0 top
C7  30.64,28.23 270 top
C8  39.75,36.49 0 top
C9  39.91,40.64 90 top
C10  17.87,58.72 270 top
C11  16.28,61.28 180 top
C12  19.68,26.51 90 top
C13  40.63,6.64 180 top
C14  40.63,10.74 180 top
C15  32.22,28.2 270 top
C16  23.75,25.7 180 top
C17  21.8,29.7 180 top
C18  11.92,57.38 270 top
C19  38.39,40.65 90 top
C20  25.7,29.51 90 top
C21  36,47.56 0 top
C22  8.51,48.88 0 top
C23  1.0uF  [0603']  8.48,51.47 180 top
C24  35.98,49.11 0 top
C25  11.62,7.32 180 top
C26  28.12,67.65 180 top
C27  13.26,61.29 0 top
C28  31.32,58.82 270 top
C29  36.02,50.64 0 top
C30  35.51,61.33 0 top
C31  35.56,59.72 0 top
C32  12.19,40.11 90 top
C33  7.29,31.51 270 top
C34  7.52,27.21 0 top
C35  9.19,27.21 0 top
C36  10.29,31.51 270 top
C37  30.18,52.74 0 top
C38  21.93,61.43 90 top
C47  23.69,27.31 90 top
C48  21.12,26.54 0 top
C49  9.28,21 0 top
C50  7.57,24.05 180 top
C51  9.26,24.08 180 top
C52  14.66,22.6 90 top
CN2  36.77,29.22 90 top
D1  35.8,44.91 0 bottom
D2  13.15,51.32 180 top
D3  13.14,54.37 0 top
D4  17.77,54.23 90 top
D5  34.72,10.03 270 bottom
D6  28.08,62.85 0 top
D7  11.56,24.59 90 top
D8  7.98,57 180 top
D9  3.2,45.22 270 top
DHT11  24.03,68.13 180 top
GND  43.66,8.17 0 top
GPS  16.45,2.6 180 top
GSM  40.18,3.7 270 top
IC2  29.5,37.79 180 top
J1  20,39.58 270 top
J2  42.73,51.5 90 bottom
J3  2.7,34.46 90 top
J7  30.26,1.76 270 top
J8  40.03,61.9 270 top
J9  40.13,48.8 270 top
L1  19.89,1.84 270 top
L2  15.85,33.02 270 top
LED1  25.28,44.72 270 top
NET  15.3,6.66 0 top
POWER  45.83,22.28 90 top
Q1  19.61,72.21 90 top
Q2  14.66,16.93 0 top
Q3  8.35,53.78 90 top
Q4  19.57,61.47 90 top
Q5  21.63,51.56 0 top
Q6  30.17,55.47 0 top
Q7  27.59,50.26 90 top
Q8  27.04,58.61 0 top
Q9  20.73,56.52 90 top
Q10  7.53,35.72 90 top
R1  36.72,68.06 180 top
R2  0R  [R0603']  15.32,9.98 180 top
R3  32.57,55.58 180 top
R4  36.53,63.77 0 top
R5  330R  [R0603']  15.3,8.33 180 top
R6  330R  [R0603']  22.32,1.82 270 top
R7  0R  [R0603']  40.18,8.7 270 top
R8  10k  [R0603']  24.92,32 180 top
R9  NC  [R0603']  28.12,64.45 180 top
R10  100k  [R0603']  23.27,56.7 90 top
R11  NC  [R0603']  28.11,66.04 180 top
R12  100K  [R0603']  27.03,54.34 0 top
R13  1M  [R0603']  15.88,48.89 180 top
R14  10k  [R0603']  26.79,25.71 0 top
R15  1M  [R0603']  18.34,49.67 270 top
R16  100k  [R0603']  12.48,48.89 180 top
R17  7.6,20.9 90 top
R18  100k  [R0603']  14.47,14.34 180 top
R19  100k  [R0603']  21.56,48.99 180 top
R20  10k  [R0603']  20.97,54.14 180 top
R21  10k  [R0603']  12.19,16.68 90 top
R22  1K  [0603']  14.41,12.88 180 top
R23  100k  [R0603']  31.3,44.52 180 top
R24  100R  [0603']  10.01,8.8 0 top
R25  1K  [R0603']  20.61,69 90 top
R26  10k  [R0603']  21.56,47.46 0 top
R27  330R  [R0603']  25.25,47.69 90 top
R28  10K  [R0603']  10.22,35.65 270 top
R29  1.2k  [0603']  17.53,43.46 90 top
R30  10k  [R0603']  26.65,71.18 90 top
R31  330R  [0603']  6.98,44.2 180 top
R32  330R  [0603']  7,45.82 180 top
R33  NC  [R0603']  20.41,58.99 180 top
R34  NC  [R0603']  19.96,64.48 0 top
R35  NC  [0603']  10.8,14.42 0 top
R36  100K  [R0603']  27.06,56 0 top
R37  100K  [R0603']  30.31,50.14 270 top
R38  7.59,17.65 270 top
R39  9.16,17.65 270 top
R40  NC  [R0603']  5.87,53.02 270 top
R41  10K  [R0603']  29.05,47.77 180 top
R42  NC  [R0603']  29.5,58.79 90 top
R43  1M  [R0603']  20.31,66.17 180 top
R44  1M  [R0603']  36.88,40.64 270 top
R45  0R  [R0603']  28.03,61.21 180 top
R46  14.66,20.97 0 top
R47  32.58,52.45 180 top
R48  0R  [0603']  38.07,26.46 180 top
R49  0R  [0603']  39.06,16.63 90 top
R50  14.58,24.16 180 top
R51  16.59,29.15 180 top
R52  8.75,40.1 0 top
R53  1K  [R0603']  11.88,35.65 90 top
R54  8.37,38.45 0 top
R55  12.29,38.36 180 top
RST  27.95,31.58 270 top
S9  11.54,39 180 bottom
SD  32,36.85 180 bottom
SIM1  31.7,19 270 bottom
STA  24.1,1.8 90 top
SW2  2.3,54.29 90 top
U1  36.16,54.01 270 top
U2  27.7,14.34 270 top
U3  33.19,67.44 90 top
U4  16.24,26.72 0 top
U5  14.49,58.55 180 top
U6  12.78,44.98 180 top
U7  10.85,11.68 270 top
U$2  [MAKERFABS-0.3]  27.87,26.43 0 bottom
WIND  3.8,21.55 270 top
X1  38.81,33.14 0 top

### Tracks (layer width: path | path; a pad name or v marks a point on that pad's centre or on a via)
5V
  Top 0.254: 7.61,23.26 R17.2 11.64,21.75 | 7.61,23.26 C50.1 4.6,23.29 WIND.1 | R46.1 13.81,21.52 | 13.81,21.52 13.81,22.51 C52.1 | 11.64,21.75 13.58,21.75 13.81,21.52 | D7.C 11.56,21.83 11.64,21.75 | C49.1 9.26,21.8 C51.1 9.2,23.26 7.61,23.26
  Top 1.016: R52.1 6.6,40.1 5V.T 3.35,40.11 J3.6 2.35,39.46 1.05,38.16 1.05,26.84 WIND.1
  pour Top: 2.7,23 4.86,23 6.69,21.17 14.23,21.17 14.23,23.05 13.01,23.05 12.3,23.76 7.19,23.76 5.44,25.51 2.75,25.51 2.7,25.51
+3V3  (via drill 0.3)
  Top 0.254: IC2.36 25.23,34.43 | 25.23,34.43 25.23,33.07 R8.2 | IC2.44 30.25,34.18 30.23,34.2 | 30.23,34.2 29.95,34.48 | 29.95,34.48 29.88,34.48 | 29.88,34.48 28.18,34.48 | 28.18,34.48 25.28,34.48 25.23,34.43 | IC2.17 30.25,41.33 28.76,39.84 28.76,37.48 28.15,36.87 28.15,34.5 28.18,34.48 | 30.87,36.41 30.94,36.48 31.86,36.48 32.92,37.55 33.77,37.55 IC2.6 38.44,37.54 C3.2 | 30,35.54 29.95,35.49 29.95,34.55 29.88,34.48 | v16.19,59.93 v16.18,59.92 U5.1 15.46,61.22 C11.2 15.51,61.29 C27.2 | R23.2 29.87,44.52 v29.6,44.79 | 29.37,45.04 29.77,45.04 30.16,45.42 30.16,46.47 30.97,46.47 31.02,46.41 31.02,44.1 30.28,43.37 30.28,41.16 28.91,39.79 28.91,37.58 28.2,36.87 28.2,34.98 28.53,34.66 29.57,34.66 29.75,34.83 29.75,35.54 30.77,36.56 31.71,36.56 | 30.87,36.41 31.93,36.41 33.05,37.52 38.54,37.52 38.74,37.73 38.74,38.08 38.23,37.58 32.64,37.58 31.6,36.53 31.4,36.53 | 30.87,36.41 30,35.54 | 30,35.54 30,34.81 30.28,34.53 30.28,31 31.93,29.35 32.54,29.35 32.9,28.99 33.89,28.99 34.35,28.53 33.89,28.53 33.69,28.74 32.34,28.74 30.23,30.84 30.23,34.02 | 30.23,34.2 30.23,34.43 30.11,34.55 29.9,34.55 29.8,34.66 29.8,34.63 29.95,34.48 | 30.23,34.2 30.23,34.02 | 30.23,34.02 29.9,34.35 25.74,34.35 25.41,34.02 25.41,33.13 24.49,32.22 24.16,32.22 24.92,32.98 24.92,35.06 25.05,35.06 25.05,33.13 25.36,33.44 25.36,35.06 25.48,34.94 | 25.48,34.94 25.48,34.25 | 25.48,34.94 25.48,35.06 25.53,35.06 25.53,34.71 25.79,34.45 27.87,34.45 28.12,34.71 28.28,34.71 28.38,34.6 28.12,34.6 28.12,36.92 28.84,37.63 28.84,39.84 30.23,41.23 30.23,44.05 29.77,44.51 29.34,44.51 29.34,45.02 29.37,45.04
  Top 0.254: 29.37,45.04 29.37,45.02 29.52,44.87 29.52,44.64 29.93,44.64 30.16,44.41 30.16,44.46 29.7,44.92 29.95,44.92 30.18,45.14 30.18,44.92 30.03,44.76 30.03,44.51 30.44,44.1 30.44,43.7 30.41,43.67 30.41,43.8 30.71,44.1
  Top 0.305: IC2.17 30.25,44.23 R23.2 | IC2.44 30.25,30.93 C15.1 33.84,28.96 CN2.1
  Top 0.813: v26.14,59.73 27.03,59.73 | 27.03,59.73 Q8.3 | 27.03,59.73 27.03,60.92 | 27.03,60.92 27.03,62.75 | 27.03,62.75 27.03,64.53 | 27.03,64.53 27.03,65.97 | 27.03,65.97 27.03,67.32 C26.2 | R11.2 27.1,66.04 27.03,65.97 | R9.2 27.11,64.45 27.03,64.53 | D6.A 27.08,62.8 27.03,62.75 | R45.2 27.27,61.16 27.03,60.92 | R27.2 v25.25,49.44 | R23.2 30.55,44.54 C6.1
  Bottom 0.813: v16.19,59.93 18.88,57.24 24.39,57.24 | 25.25,58.02 25.25,58.84 v26.14,59.73 | 25.25,56.98 25.25,56.37 | 25.25,56.37 v25.25,49.44 25.25,45.7 26.17,44.79 v29.6,44.79 | 24.39,57.24 24.47,57.24 | 24.47,57.24 25,57.24 25.25,56.98 | 24.47,57.24 25.25,58.02 | 25.25,58.02 25.25,56.98 | 25.25,56.37 24.39,57.24
  pour Top: 13.49,61.76 15.93,61.76 16.06,61.63 16.06,60.56 16.49,60.13 16.49,59.67 16.44,59.62 15.35,59.62 15.35,60.44 15.02,60.77 13.54,60.77 13.49,60.77
A0  (via drill 0.3)
  Top 0.254: R39.2 | IC2.3 32.51,36.04 31.76,35.29 v30.69,35.29
  Top 0.406: R38.2 R39.2 9.91,16.8 v11.08,17.97
  Bottom 0.254: v11.08,17.97 12.25,17.97 12.81,18.53 12.81,32.39 14.28,33.87 22.99,33.87 26.12,36.99 29.32,36.99 30.69,35.62 v30.69,35.29
A1  (via drill 0.3)
  Top 0.254: C9.1 39,38.97 38.31,38.97 37.38,38.04 IC2.7 32.33,38.04 31.55,37.27 v30.66,37.27
  Top 0.305: R55.2 11.69,38.11 v11.69,37.5
  Top 0.406: R54.2 11.35,38.45 R55.2
  Bottom 0.254: v30.66,37.27 30.51,37.27 28.86,38.92 23.37,38.92 23.02,38.57 23.02,35.49 22.51,34.98 12.88,34.98 11.69,36.18 v11.69,37.5
A2  (via drill 0.3)
  Top 0.254: R13.1 18.32,48.89 R15.2 18.34,48.32 22.36,44.31 v22.36,42.88 | C19.1 37.04,38.54 IC2.8 31.96,38.54 31.53,38.11 v30.66,38.11
  Bottom 0.254: v30.66,38.11 30.56,38.11 29.24,39.43 25.48,39.43 24.42,40.5 23.07,40.5 22.61,40.95 22.61,42.63 v22.36,42.88
A3  (via drill 0.3)
  Top 0.254: v30.66,38.95 30.76,39.04 IC2.9 36.63,39.04 36.89,39.3 R44.2 | R43.1 22.1,65.13 22.1,63.79 24.24,61.66 24.24,51.34 23.5,50.61 23.5,41.79 v23.32,41.62
  Bottom 0.254: v23.32,41.62 23.35,41.64 24.14,41.64 25.76,40.02 29.6,40.02 v30.66,38.95
A4  (via drill 0.3)
  Top 0.254: 40.05,51.77 J9.1 | IC2.10 35.65,39.54 v35.85,39.73
  Top 0.61: J9.1 39.17,51.8 v38.06,50.68
  Bottom 0.254: v35.85,39.73 35.85,40.78 38.72,43.65 38.72,50.17 38.21,50.68 v38.06,50.68
A5  (via drill 0.3)
  Top 0.254: IC2.47 31.75,32.91 31.93,32.73 33.41,32.73 v33.51,32.83
  Top 0.61: J9.2 v38.08,49.8 v38.08,49.79
  Bottom 0.254: v38.08,49.79 38.08,43.85 35.19,40.95 35.19,34.5 v33.51,32.83
AREFA
  Top 0.254: 38.93,36.54 C8.1 38.65,36.15 34.83,36.15 34.44,36.54 IC2.4
D0  (via drill 0.3)
  Top 0.254: IC2.16 30.75,41.33 31.22,40.85 32.7,40.85 34.09,42.25 39.81,42.25 v40.06,42.5 | R48.1 40,26.46 v40.01,26.45
  Bottom 0.254: v40.01,26.45 40.42,26.86 40.42,42.15 v40.06,42.5
D1  (via drill 0.3)
  Top 0.254: IC2.15 31.25,41.56 31.5,41.31 32.47,41.31 33.87,42.71 39.22,42.71 39.76,43.24 v40.47,43.24 | R49.1 v40.04,15.78 | v40.04,15.78
  Bottom 0.254: v40.04,15.78 40.88,16.62 40.88,42.83 v40.47,43.24
D2
  Top 0.254: R41.2 27.25,46.73 IC2.23
D3  (via drill 0.3)
  Top 0.305: IC2.14 31.75,43.65 | 31.75,43.65 31.75,44.21 R23.1 | v31.58,43.62 31.73,43.62 31.75,43.65 | v5.49,41.26 v17.38,41.26
  Bottom 0.305: v31.58,43.62 30.97,43.01 24.77,43.01 23.73,44.05 20.17,44.05 v17.38,41.26 v17.37,41.25 S9.4 | S9.3 5.5,41.25 v5.49,41.26
D4  (via drill 0.3)
  Top 0.254: IC2.13 33.52,43.34 v36.56,43.34
  Bottom 0.254: D1.1 v36.55,43.35 v36.56,43.34 34.7,41.49 34.7,35.06 33.19,33.55 SD.2
D5  (via drill 0.3)
  Top 0.254: IC2.24 26.75,41.59 26.98,41.36 26.98,36.03 v26.22,35.27 | U2.32 24.7,8.46 v24.64,8.52
  Bottom 0.254: v26.22,35.27 23.81,32.85 20.43,32.85 18.83,31.25 18.83,14.34 v24.64,8.52
D6  (via drill 0.3)
  Top 0.254: IC2.29 24.11,38.54 v23.73,38.16 | R21.2 11.94,17.7 v11.94,18.78
  Bottom 0.254: v23.73,38.16 23.73,35.27 22.87,34.4 13.95,34.4 12.3,32.75 12.3,19.14 v11.94,18.78
D7
  Top 0.254: IC2.30 24.55,38.04 23.96,37.45 23.43,37.45 22.87,38.01 22.87,41.06 22.64,41.28 22.64,42.02 23.02,42.4 23.02,46.77 R26.2
D8  (via drill 0.3)
  Top 0.254: IC2.11 33.28,40.04 32.85,39.61 30.33,39.61 30,39.28 30,36.76 v29.32,36.08 | R2.2 14.54,10 14.54,10.86 v14.46,10.93
  Bottom 0.254: v29.32,36.08 28.96,36.43 26.35,36.43 23.27,33.36 14.74,33.36 13.32,31.94 13.32,12.07 v14.46,10.93
D9  (via drill 0.3)
  Top 0.254: U2.9 25.9,25.58 R14.1 v26.04,27.04 | v28.91,35.34 28.66,35.59 28.66,36.53 29.52,37.4 29.52,39.53 30.13,40.14 32.67,40.14 33.08,40.55 IC2.12
  Bottom 0.254: 28.63,35.62 v28.91,35.34 28.3,35.95 27.13,35.95 26.85,35.67 26.85,27.85 v26.04,27.04
D10  (via drill 0.3)  (1 unrouted)
  Top 0.254: IC2.27 24.2,39.54 v24.01,39.73
  Top 0.406: 11.89,36.41 v12.83,36.41
  Bottom 0.254: v12.83,36.41 13.72,35.52 21.85,35.52 22.48,36.15 22.48,38.8 23.43,39.73 v24.01,39.73
D11
  Top 0.254: IC2.25 25.23,43.9 LED1.-
D12
  Top 0.254: IC2.28 23.71,39.04 23.37,39.38 23.37,40.14 23.96,40.73 23.96,50.3 24.72,51.06 24.72,61.83 22.61,63.94 22.61,66.23 R25.1
D13
  Top 0.254: IC2.26 24.72,40.04 24.42,40.34 24.42,49.95 25.23,50.76 25.23,69.43 | 25.23,69.43 26.22,70.42 R30.1 | 25.23,69.43 25,69.43 | DHT11.3 24.06,69.43 24.92,69.43 25,69.43 | 25,69.43 25.2,69.22
D+
  Top 0.254: J1.D+ 21.73,39.58 21.93,39.38 21.93,37.5 23.4,36.03 25.21,36.03 IC2.34
D-
  Top 0.254: J1.D- 21.92,40.23 22.41,39.73 22.41,37.73 23.6,36.53 IC2.33
DONE
  Top 0.61: R32.1 8.05,45.62 U6.6
GND  (via drill 0.3)
  Top 0.254: IC2.18 29.75,43.6 v29.55,43.8 | IC2.5 37.47,37.04 37.7,36.81 | U1.7 v36.49,55.66 v36.48,55.66
  Bottom 0.254: SD.6 33.09,37.95 33.33,38.19 33.33,41.86 SD.G1
  other vias: 2.32,66.35 2.04,8.19 1.84,11.59 1.53,18.63 1.91,62.87 1.63,24.24 37.6,36.87 38.51,55.81 33.51,49.62 32.09,48.96 32.37,50.28 17.02,50.4 11.31,46.26 11.79,47.38 12.45,45.73 12.78,46.85 12.91,44.33 11.31,44.87 11.28,43.14 12.76,42.53 12.2,43.75 13.16,46.11 13.16,43.49 12.15,44.84 11.87,42.2 23.15,52.49 23.15,53.96 27.77,52.64 32.42,61.81 30.79,62.09 33.33,62.44 29.27,69.73 30.54,67.85 15.96,68.95 17.86,69.4 9.94,72.98 7.75,68.54 8.34,65.03 9.12,61.17 7.73,73.44 38.69,73.42 40.88,70.85 22.54,73.95 15.83,73.54 42.04,73.29 43.11,68.46 47.58,64.02 47.53,60.61 45.98,64.3 39.12,57.31 47.73,51.42 47.68,48.8 43.82,44.99 37.01,44.89 33.31,48.02 47.1,37.83 46.67,40.42 47.3,34.55 46.34,29.52 43.62,36.66 47.38,22.59 44.96,24.14 43.8,17.18 47.76,15.35 48.24,10.14 40.77,13.6 34.75,2.85 37.42,5.24 42.53,1.15 42.42,7.02 38.69,8.32 45.22,7.38 38.74,5.85 39.63,12.46 5.57,8.65 1.86,15.02 4.93,15.91 20.53,19.24 25.08,12.84 27.82,10.09 30.61,7.71 27.24,7.53 34.3,15 20.61,16.72 20.43,9.76 20.28,7.68 13.95,0.82 9.79,1.18 18.02,5.62 14,5.04 16.47,13.7 17.05,23.43 29.65,26.4 34.14,26.58 38.46,24.7 45.24,33.64 34.5,31.99 36.63,34.71 37.88,34.73 39.66,31.51 33,43.88 20.63,44.99 1.35,47.25 1.2,45.15 0.92,40.62 1.35,43.27 5.01,42.61 0.92,57.46 0.72,55.84 0.72,53.02 0.79,50.68 25.99,61.55 25.91,63.48 26.07,68.01 25.91,65.82 26.96,73.95 29.27,73.87 31.86,74.03 35.54,73.9 38.82,71.49 13.37,73.95 20.61,21.6 20.83,14.79 24.49,14.87 26.19,10.55 33.28,14.54 30.51,17.46 34.73,19.69 25.89,1.46 10.34,62.8 12.25,59.67 13.21,59.04 15.98,58.56 15.37,58.89 15.35,58.15 13.19,58.28 16.74,62.44 16.26,67.19 22.21,69.86 30.18,70.6 31.5,61.05 33.13,44.64 37.42,45.76 36.02,44.87 27.21,53.17 27.21,51.93 39.45,66.2 41,66.2 36.18,66.1
  pour Top (rank 6): 0,-0.5 50,-0.5 50,75.5 0,75.5
  pour Bottom (rank 6): 50,-0.5 50,75.5 0,75.5 0,-0.5
GPS_RF
  Top 0.61: GPS.D L1.1 19.9,2.61 U2.28
GSM_RF
  Top 0.406: U2.45 C14.2 R7.1
HRXD
  Top 0.254: U2.38 31.9,2.66 J7.1
HTXD
  Top 0.254: U2.37 30.7,2.2 J7.2
IO27
  Top 0.406: U2.26 16.06,8.34 R5.1 16.08,8.33 R2.1
IO28
  Top 0.406: U2.30 22.3,2.6 R6.1
ISET
  Top 0.61: U6.2 17.49,44.35 R29.2
MISO  (via drill 0.3)
  Top 0.254: v28.02,46.54 27.74,46.26 27.74,43.14 28.25,42.63 IC2.21 28.25,41.54 27.79,41.08 v27.62,41.08
  Bottom 0.254: v28.02,46.54 28.61,47.13 36.12,47.13 36.55,46.7 D1.6 | SD.7 31.98,39.02 31.5,39.02 29.45,41.08 v27.62,41.08
MOSI  (via drill 0.3)
  Top 0.254: v29.45,45.76 29.42,45.76 28.71,45.04 28.71,43.67 29.25,43.13 IC2.19 29.25,41.04 28.25,40.04 28.25,37.8 27.49,37.04 v27.49,35.21 | 35.01,44.69 v35.06,44.74 34.2,44.74 v33.18,45.76
  Bottom 0.254: v29.45,45.76 v33.18,45.76 | D1.3 v35.05,44.73 v35.06,44.74 | v27.49,35.21 28.06,34.65 SD.3
N$1
  Top 0.406: R6.2 24.08,1.06 STA.+
N$2
  Top 1.778: D2.C D3.A
N$3
  Top 0.61: Q4.1 21.79,60.52 C38.1 22.31,60.66 23.27,59.7 R10.2
N$4
  Top 0.61: R26.1 R19.2 20.8,50.42 Q5.1
N$5
  Top 0.254: LED1.+ 25.28,46.9 R27.1
N$6
  Top 0.406: D6.C 29.08,61.12 | 29.08,61.12 29.08,59.97 29.14,59.91 | 29.14,59.91 R42.2 | R45.1 28.99,61.21 29.08,61.12 | 28.56,59.32 27.99,58.76 Q8.2 27.99,56.18 R36.2 28.32,55.51 30.08,55.51 Q6.2 31.12,52.92 C37.2 | 28.71,59.47 29.14,59.91 | 29.55,59.32 28.56,59.32 | 28.56,59.32 28.71,59.47 | 28.71,59.47 29.19,59.47
N$7
  Top 0.406: NET.+ R5.2
N$8
  Top 0.406: U2.18 Q2.3
N$9
  Top 0.406: BUZZER.4 18.39,72 Q1.3
N$10
  Top 0.254: R38.1 7.59,18.98 | 7.59,18.98 7.59,20.04 R17.1 | WIND.3 7.57,19.01 7.59,18.98
  pour Top: 2.98,20.15 6.46,20.15 6.89,20.58 8.06,20.58 8.06,17.92 3.08,17.92 2.98,17.92
N$11  (via drill 0.3)
  Top 0.254: v22.1,58.99
  Top 0.61: 20.72,63.25 R34.2 | C38.2 21.8,62.32 20.67,62.32 Q4.2 20.72,62.57 20.72,63.25 | 20.72,63.25 v20.66,63.31 | R20.2 20.71,54.64 20.71,56.47 21.7,57.47 Q9.2 21.73,58.61 v22.1,58.99 R33.1
  Top 0.813: D4.C 18.27,52.2 R20.2
  Bottom 0.61: v22.1,58.99 22.1,61.86 v20.66,63.31
N$12
  Top 0.406: R18.2 Q2.1 | Q2.1 | Q2.1 12.21,15.91 R21.1
N$13
  Top 0.61: D9.1 5.14,45.82 R32.2
N$14
  Top 0.61: R31.1 7.97,44.35 U6.7
N$15
  Top 0.406: Q8.1 26.09,56.21 R36.1 26.3,54.37 R12.1 26.27,50.56 Q7.3
N$16
  Top 0.61: U7.5 10.85,8.81 R24.2
  Top 0.813: R24.2 C25.2
N$17
  Top 0.61: U7.1 R22.2
N$18
  Top 0.61: D9.2 4.72,44.2 R31.2
N$19
  Top 0.406: Q7.1 29.52,49.31 | 29.52,49.31 30.24,49.31 R37.2 | R41.1 29.81,49.02 29.52,49.31
N$20
  Top 0.406: U1.5 R3.1 R47.2
N$21
  Top 0.254: U2.53 38.19,20.34 39.07,19.47 39.07,17.5 R49.2
N$22
  Top 0.254: U2.54 37.2,26.44 R48.2
N$23
  Top 0.254: U4.1 14.03,27.67 | 14.03,27.67 12.62,27.67 D7.A | L2.P$2 14,27.69 14.03,27.67
  pour Top: 10.34,25.71 10.34,27.34 12.15,29.14 12.88,29.88 12.88,35.09 14.71,35.09 14.71,28.53 14.94,28.31 15.68,28.31 15.68,27.42 14.03,27.42 13.01,26.4 13.01,25.77 13.01,25.71
N$24
  Top 0.406: Q1.1 20.63,69.77 R25.2
N$25
  Top 0.61: U4.3 15.43,25.38 R50.1 15.42,24.15 C52.2 15.51,22.51 R46.2
N$26
  Top 0.406: U4.6 | U4.6 R51.1
N$27  (via drill 0.3)
  Top 0.254: J3.1 7.35,29.46 | 7.35,29.46 9.35,29.46 | 9.35,29.46 9.89,29.46 C36.A | C33.A 7.52,29.64 C34.1 7.52,29.29 7.35,29.46 | C35.1 9.19,29.3 9.35,29.46
  Top 0.813: R52.2 10.56,40.1 v10.57,40.12 v10.58,40.11 C32.1 | v10.57,30.95 10.57,30.14 C36.A
  Bottom 0.813: v10.57,40.12 v10.57,30.95
  pour Top: 2.09,30.44 9.12,30.44 10.04,31.35 11.54,31.35 11.54,29.4 9.76,27.62 2.22,27.62 2.09,27.62
N$28
  Top 0.406: Q10.1 10.11,34.77 R28.2 R53.1 | R53.1
N$29
  Top 0.61: J3.3 4.26,33.46 Q10.3
N$30
  Top 0.61: J3.5 4.92,37.46 5.9,38.44 R54.1
N$31
  Top 0.61: R10.1 22.9,55.57 Q9.1 R20.1 21.73,52.68 Q5.3
N$32
  Top 0.406: C37.1 29.42,54.27 Q6.1 29.09,54.34 R12.2
N$94
  Top 0.406: R7.2 | R7.2 C13.2 GSM.D
PA00_XIN32
  Top 0.254: X1.P$2 37.53,33.23 C5.1 34.41,35.04 IC2.1
PA01_XOUT32
  Top 0.254: IC2.2 38.58,35.54 C4.1 40.01,34.11 X1.P$1
RESET  (via drill 0.3)
  Top 0.254: R8.1 25.68,31.43 | 25.68,31.43 25.68,30.29 C20.2 | IC2.40 28.25,31.88 RST.1 | RST.1 25.84,31.58 25.68,31.43 | RST.1 28.4,31.12 v28.4,30.62
  Bottom 0.254: CN2.10 39.31,30.58 38.64,31.25 29.04,31.25 v28.4,30.62
SCK  (via drill 0.3)
  Top 0.254: v27.62,38.2 27.62,40.14 28.75,41.27 IC2.20 28.75,42.87 28.23,43.39 28.23,45.58 v28.58,45.93
  Bottom 0.254: v27.62,38.2 28.82,38.2 30.41,36.61 31.76,36.61 SD.5 | v28.58,45.93 29.22,46.57 35.59,46.57 35.8,46.37 D1.5
SCL  (via drill 0.3)
  Top 0.254: IC2.32 26.04,37.04 26.47,37.48 26.47,41.11 26.25,41.34 26.25,42.71 26.75,43.22 26.75,47.69 v27.11,48.04
  Top 0.406: U1.4 34.5,52.52 v34.5,51.57
  Top 0.61: R9.1 29.37,64.45 30.11,63.71 33.66,63.71 34.45,64.5 | 34.45,64.5 34.45,65.31 | 34.45,65.31 34.45,65.83 U3.3 | R4.1 34.48,64.53 34.45,64.5 | 34.45,65.31 34.86,64.9 J8.1 41.68,64.9 v41.71,64.93
  Bottom 0.61: v41.71,64.93 44.13,62.52 J2.3 43.27,52.77 42.07,51.57 v34.5,51.57 30.64,51.57 v27.11,48.04
SDA  (via drill 0.3)
  Top 0.254: R1.1 | IC2.31 25.78,37.54 25.99,37.75 25.99,40.85 25.74,41.11 25.74,42.94 26.3,43.49 26.3,48.45 v26.85,49.01
  Top 0.406: U1.3 35.84,52.58 v35.67,52.41
  Top 0.61: R11.1 29.22,66.04 30.61,64.65 32.8,64.65 33.2,65.06 33.2,65.83 U3.2 33.19,66.9 33.59,67.29 36.71,67.29 R1.1 | R1.1 42.48,67.29 43.39,66.38 43.39,63.76 42.53,62.9 v41.84,62.9 J8.2
  Bottom 0.61: J2.4 41.84,55.82 | 41.84,55.82 41.84,56.27 v41.84,62.9 | v26.85,49.01 30.26,52.41 v35.67,52.41 41.15,52.41 41.84,53.1 41.84,55.82
SIM_CLK  (via drill 0.3)
  Top 0.254: U2.41 35.5,6.07 34.96,6.61 v34.96,8.24
  Bottom 0.254: SIM1.3 24.12,17.48 32.31,9.28 D5.4 | v34.96,8.24 34.22,8.24 33.81,8.65 D5.4 | D5.4
SIM_DATA  (via drill 0.3)
  Top 0.254: U2.39 33.1,9.97 v32.87,10.2
  Bottom 0.254: SIM1.7 25.39,16.97 32.34,10.02 32.85,10.02 | D5.5 33.8,10.02 32.85,10.02 | v32.87,10.2 32.85,10.17 32.85,10.02
SIM_RST  (via drill 0.3)
  Top 0.254: U2.42 35.88,7.14 v35.64,7.38
  Bottom 0.254: SIM1.2 26.66,17.53 32.37,11.82 34.14,11.82 34.68,11.29 34.68,9.54 34.93,9.28 D5.3 35.64,9.26 v35.64,7.38
SIM_VDD  (via drill 0.3)
  Top 0.254: U2.40 34.3,11.98 v34.86,12.53
  Bottom 0.254: SIM1.1 29.2,15.88 32.54,12.53 34.32,12.53 v34.86,12.53 35.06,12.53 35.62,11.97 D5.1 | D5.1
SWCLK  (via drill 0.3)
  Top 0.254: IC2.45 30.75,31.5 v31.71,30.54
  Bottom 0.254: CN2.4 35.5,30.36 35.08,30.77 31.93,30.77 v31.71,30.54
SWDIO
  Top 0.254: IC2.46 31.25,32.11 33.51,29.85 CN2.2
VBAT+  (via drill 0.3)
  Top 0.254: BAT.1 9,8.64 R24.1 9.15,8.82 9.15,9.08 v8.59,9.64 | SW2.1 5.84,52.29 R40.2 5.87,49.94
  Top 0.61: 5.87,49.94 6.93,48.88 C22.1 9.11,46.89 U6.5
  Bottom 0.254: v8.59,9.64 8.59,46.95 v8.69,47.05
  Bottom 1.016: 9.15,46.59 v8.69,47.05
  pour Top: 7.86,2.45 7.86,9.97 9.07,9.97 9.63,9.41 9.63,2.47 9.63,2.45
  pour Bottom: 9.68,47.76 9.68,9.1 8.16,9.1 8.16,46.97 8.16,47.05 8.87,47.76
  pour Top: 10.34,46.54 8.64,46.54 7.7,47.48 5.87,47.48 5.11,48.24 5.11,50.73 4.5,51.34 1.48,51.34 1.48,52.8 6.69,52.8 6.69,50.61 6.99,50.3 8.21,50.3 8.21,48.47 9.28,47.41 10.34,47.41
VBAT-
  Top 0.254: BAT.2 12.38,4.88 C25.1 12.38,9.91 U7.6 11.79,10.5 11.79,11.54 11.54,11.8 10.12,11.8 9.9,12.01 U7.3 9.9,14.38 R35.1
  pour Top: 10.34,2.42 10.34,5.17 11.82,6.64 11.82,9.76 11.54,10.04 11.54,11.11 11.31,11.34 9.63,11.34 9.3,11.67 9.3,15 10.5,15 10.5,13.88 10.22,13.6 10.22,12.23 10.39,12.05 12.35,12.05 13.06,11.34 13.06,2.58 13.06,2.42
VBAT_IN
  Top 0.254: 5.87,54.29 R40.1 Q3.3 | 5.87,54.29 5.87,56.92 D8.A | SW2.2 5.87,54.29
  pour Top: 1.45,53.58 7.7,53.58 7.7,58.3 4.91,58.3 4.91,56.07 4.15,55.31 1.53,55.31 1.45,55.31
VBUS  (via drill 0.3)
  Top 0.254: R16.1 R13.2 15.12,47.65 U6.4 15.9,46.9 18.07,46.9 19.41,45.55 19.41,42.99 | J1.VBUS 20.3,40.88 v19.65,41.53 | Q3.1 9.33,52.81 C23.1 10.98,51.47 D2.A 11.86,50.58 v12.38,50.58 13.25,49.71 R16.1 | 13.24,48.9 R16.1
  Top 0.61: v38.78,21.28 v38.77,21.27 | U6.8 9.67,43.06 v7,43.06
  Top 0.813: POWER.+ v38.78,21.28
  Top 1.016: v19.65,41.53 19.41,41.77 19.41,42.99 | v21.6,31.73 19.18,34.15 v19.18,37.3
  Bottom 0.813: 5.9,46.39 5.9,44.43 5.63,44.43 5.02,45.05
  Bottom 1.016: v38.77,21.27 33.2,21.27 32.24,22.23 23.25,22.23 21.6,23.89 v21.6,31.73 | v19.18,37.3 20.82,38.94 20.82,40.35 v19.65,41.53
  Bottom 1.27: 4.76,45.22 10.12,50.58 v12.38,50.58 | D9.COM 4.76,45.22 | v7,43.06 5.02,45.05 4.84,45.22 4.76,45.22
  pour Top: 38.46,22.3 38.46,20.5 42.83,20.5 42.83,22.3
  pour Top: 10.37,43.29 6.81,43.29 6.64,43.11 6.64,42.35 10.42,42.35 10.42,43.24
  pour Top: 8.77,53.15 8.77,51.09 9.79,51.09 10.62,50.25 11.89,50.25 12.83,49.31 12.83,48.19 13.52,48.19 15.12,46.59 15.35,46.36 17.74,46.36 18.57,45.53 18.57,41.89 19.74,40.73 21.72,40.73 21.75,40.75 21.75,41.31 20.48,41.31 20,41.79 19.87,41.92 19.87,42.83 19.87,46.01 18.24,47.63 16.24,47.63 15.73,48.14 15.73,49.64 14.26,49.64 13.04,50.86 13.04,52.56 10.04,52.56 9.76,52.84 9.76,53.15
VCC  (via drill 0.3)
  Top 0.254: DHT11.4 26.57,71.94 | 26.57,71.94 33.34,71.94 34.47,70.8 34.47,69.05 U3.4 36.5,69.04 R1.2 | R30.2 26.58,71.95 26.57,71.94 | R42.1 30.13,58.03 | 30.13,58.03 31.29,58.03 C28.2 32.37,58.05 | Q6.3 30.17,57.99 30.13,58.03 | 36.33,60.82 C31.2 36.37,59.67 C1.1 36.37,57.18 | 36.33,60.82 36.33,61.28 C30.2 36.27,62.75 R4.2 | 36.33,60.82 36.41,60.9 v37.52,60.9 J8.3 | 32.37,58.05 C2.1 | 32.37,58.05 32.57,57.85 R3.2 32.89,56.65 35.85,56.65 | J9.3 37,47.8 C21.2 36.74,47.58 C24.2 36.74,50.61 C29.2 36.49,50.93 U1.2 | 36.37,57.18 35.85,56.65 | 35.85,56.65 U1.6 | U1.8 37.14,56.42 36.37,57.18
  Top 0.406: 37.47,55.33 37.5,55.36 37.5,60.18 37.93,60.61 39.3,60.61 39.3,61.2 37.47,61.2 37.22,60.94 37.22,57.08
  Top 0.61: C21.2 36.76,46.7 35.87,45.81 v34.48,45.81 | R1.2 37.53,68.83 v37.6,68.89
  Top 0.813: 39.95,60.92 J8.3
  Top 1.016: J9.3 42.76,47.8 43.52,48.55 v43.52,50.25 43.52,59.39 41.99,60.92 37.54,60.92 v37.52,60.9
  Bottom 0.61: SD.4 33.38,35.75 34.04,36.41 34.04,45.37 v34.48,45.81 D1.4 | v37.6,68.89 37.6,60.98 v37.52,60.9
  Bottom 0.813: J2.2 43.5,50.23 v43.52,50.25
  pour Top: 29.09,58.43 33.33,58.43 33.51,58.25 33.51,57.46 33.76,57.21 35.57,57.21 35.82,57.46 35.82,63.38 37.01,63.38 37.01,61.88 37.65,61.25 39.5,61.25 39.5,60.54 37.57,60.54 37.01,59.98 37.01,57.59 37.57,57.03 37.57,54.67 37.09,54.67 37.09,56.17 36.86,56.4 36.15,56.4 35.9,56.14 35.9,54.7 35.74,54.7 35.74,55.79 35.46,56.07 35.31,56.22 29.75,56.22 29.09,56.88
  pour Top: 36.33,53.43 36.33,46.85 35.74,46.26 34.27,46.26 34.17,46.16 34.17,45.63 34.27,45.53 36.13,45.53 37.93,47.33 38.03,47.43 39.1,47.43 39.1,48.17 37.95,48.17 37.34,48.78 37.34,51.88 36.68,52.54 36.61,52.61 36.61,53.43
  pour Top: 23.25,72.86 34.47,72.86 38.28,69.05 38.28,68.2 34.09,68.2 34.09,70.7 33.18,71.61 23.25,71.61
VDD  (via drill 0.3)
  Top 0.254: U4.4 U4.5 18.77,26.72 19.32,27.28 C12.2 | 22.81,27.43 C47.1 | U2.12 22.99,23.74 | 22.99,23.74 U2.11 | 22.99,23.74 22.99,23.75 C16.2 22.99,27.25 C47.1 | L1.2 | BUZZER.1 18.4,64.38 | 18.4,64.38 19.1,64.38 R34.1 19.55,64.83 R43.2 | Q4.3 18.47,64.31 18.4,64.38 | v15.45,38.69 17.7,36.44 L2.P$1 18.94,33.02 20.15,31.81 C17.A 19.68,29.23 C12.2 | C12.2 19.7,27.3 C48.1 C47.1
  Top 0.813: U2.12 v22.31,8.04 | L1.2 v20.83,1.08
  Bottom 0.813: v22.31,8.04 22.31,2.55 v20.83,1.08
  Bottom 1.016: v15.45,38.69 14.26,39.89 14.26,63.08 BUZZER.1
  pour Top: 16.9,26.98 18.19,26.98 18.5,27.29 18.5,30.08 17.96,30.62 16.01,30.62 16.01,36.03 14.76,37.27 14.76,39.48 16.16,39.48 16.77,38.87 16.77,37.4 18.57,35.59 18.57,33.39 20.76,31.2 20.76,28.71 21.39,28.08 23.3,28.08 23.78,27.59 23.78,22.97 21.98,22.97 21.98,26.63 21.65,26.96 19.64,26.96 17.91,25.23 16.87,25.23 16.87,26.96
  pour Top: 11.77,65.21 17.02,65.21 18.6,66.79 19.74,66.79 19.92,66.61 19.92,63.38 19.29,62.75 19.29,61.02 18.07,61.02 18.07,62.9 17.41,63.56 11.82,63.56 11.77,63.61
VDDCORE
  Top 0.254: IC2.43 29.75,29.88 C7.1
VIN
  Top 0.254: Q3.2 10.06,54.73 | 10.06,54.73 10.76,54.73 D3.C | 10.06,54.73 10.01,54.79 D8.C 10.39,56.62 C18.2 12.29,56.25 13.47,56.25 | 15.47,56.25 13.47,56.25 | U5.5 13.51,56.29 13.47,56.25 | U5.8 15.46,56.26 15.47,56.25 | R33.2 19.63,58.97 Q9.3 19.45,56.34 17.87,56.34 | C10.2 17.87,56.34 | 17.87,56.34 D4.A 15.47,56.25
  Top 0.61: 18.95,57.49 18.95,56.42 19.06,56.32
  pour Top: 8.95,58.48 8.95,54.31 9.1,54.16 10.06,54.16 10.34,53.88 10.34,53.22 12.86,53.22 12.86,55.03 13.67,55.84 13.75,55.91 15.12,55.91 19.79,55.91 19.95,56.07 19.95,59.39 18.95,59.39 18.9,59.34 18.9,58.71 18.57,58.38 17.08,58.38 16.11,57.41 15.37,57.41 15.37,56.75 15.2,56.58 13.82,56.58 13.65,56.75 13.65,57.41 11.26,57.41 10.9,57.77 10.9,58.45 10.9,58.48
VIO  (via drill 0.3)
  Top 0.254: U2.43 36.15,8.34 35.82,8.67 v35.82,22.37 | v35.8,25.13 28.13,25.13 R14.2
  Bottom 0.254: v35.82,22.37 35.82,25.11 v35.8,25.13

### Text on the board
tPlace: - | VCC | D13 | SCL | + | SDA | GND | VCC | GND | A4 | A5 | VCC | GND | - | + | + | -
bPlace: OFF | SDA | ON | SCL | +3V3 | GND | 5V | AD1 | GND | !D10 | GND | VLED | 5V | Wind Weather Station V2.1 | GND | www.makerfabs.com | A0 | GND | TXD | RXD